# Altium project netv2mvp-dvt1.PrjPcb (part 1 of 2)
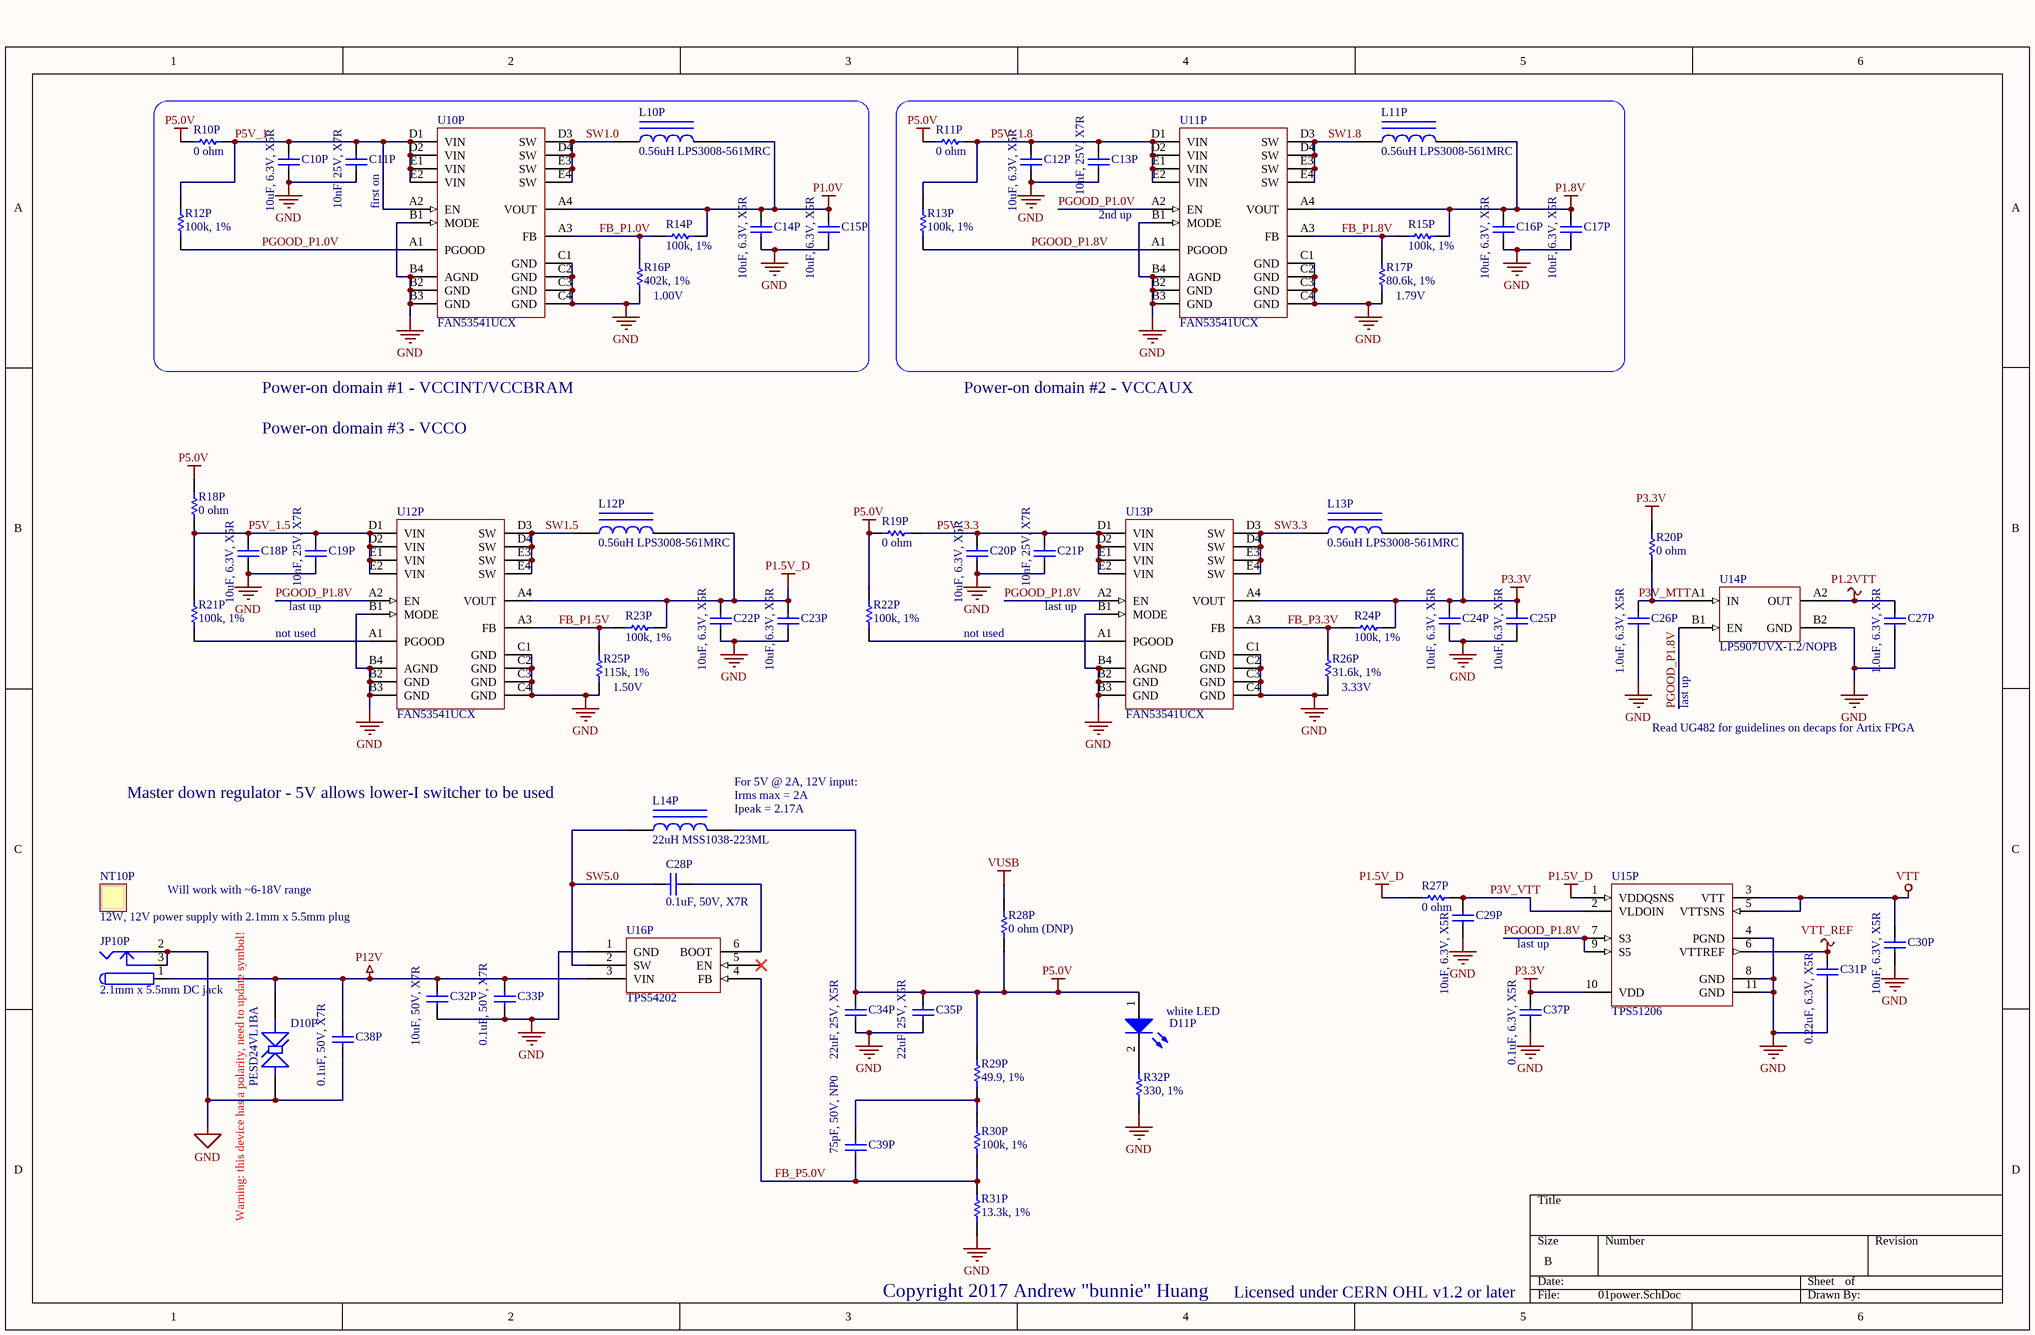
[diagram p0: 01power.SchDoc]
5 sheets, 330 parts. Net scope: global (net labels, ports and power ports of the same name join across sheets).
Board file: netv2mvp-dvt1a.PCBDOC
Sheets:
  01power.SchDoc
  02config.SchDoc
  03fpga.SchDoc
  04ddr3.SchDoc
  05io.SchDoc

## Sheet 01power.SchDoc
size B

### Parts
C10P  10uF, 6.3V, X5R  [CAPC1608N]
C11P  10nF, 25V, X7R  [CAPC1005N]
C12P  10uF, 6.3V, X5R  [CAPC1608N]
C13P  10nF, 25V, X7R  [CAPC1005N]
C14P  10uF, 6.3V, X5R  [CAPC1608N]
C15P  10uF, 6.3V, X5R  [CAPC1608N]
C16P  10uF, 6.3V, X5R  [CAPC1608N]
C17P  10uF, 6.3V, X5R  [CAPC1608N]
C18P  10uF, 6.3V, X5R  [CAPC1608N]
C19P  10nF, 25V, X7R  [CAPC1005N]
C20P  10uF, 6.3V, X5R  [CAPC1608N]
C21P  10nF, 25V, X7R  [CAPC1005N]
C22P  10uF, 6.3V, X5R  [CAPC1608N]
C23P  10uF, 6.3V, X5R  [CAPC1608N]
C24P  10uF, 6.3V, X5R  [CAPC1608N]
C25P  10uF, 6.3V, X5R  [CAPC1608N]
C26P  1.0uF, 6.3V, X5R  [CAPC0603X03L]
C27P  1.0uF, 6.3V, X5R  [CAPC0603X03L]
C28P  0.1uF, 50V, X7R  [CAPC2012N]
C29P  10uF, 6.3V, X5R  [CAPC1608N]
C30P  10uF, 6.3V, X5R  [CAPC1608N]
C31P  0.22uF, 6.3V, X5R  [CAPC0603X03L]
C32P  10uF, 50V, X7R  [CAPC3216N]
C33P  0.1uF, 50V, X7R  [CAPC2012N]
C34P  22uF, 25V, X5R  [CAPC3216N]
C35P  22uF, 25V, X5R  [CAPC3216N]
C37P  0.1uF, 6.3V, X5R  [CAPC0603X03L]
C38P  0.1uF, 50V, X7R  [CAPC2012N]
C39P  75pF, 50V, NP0  [CAPC1005N]
D10P  PESD24VL1BA  [SOD-323]
D11P  white LED  [CD2012-0805]
JP10P  2.1mm x 5.5mm DC jack  [CUI_PJ_002AH_SMT]
L10P  0.56uH LPS3008-561MRC  [COILCRAFT_LPS3008]
L11P  0.56uH LPS3008-561MRC  [COILCRAFT_LPS3008]
L12P  0.56uH LPS3008-561MRC  [COILCRAFT_LPS3008]
L13P  0.56uH LPS3008-561MRC  [COILCRAFT_LPS3008]
L14P  22uH MSS1038-223ML  [COILCRAFT_MSS1038]
NT10P  12W, 12V power supply with 2.1mm x 5.5mm plug
R10P  0 ohm  [RESC1608N]
R11P  0 ohm  [RESC1608N]
R12P  100k, 1%  [RESC1005N]
R13P  100k, 1%  [RESC1005N]
R14P  100k, 1%  [RESC1005N]
R15P  100k, 1%  [RESC1005N]
R16P  402k, 1%  [RESC1005N]
R17P  80.6k, 1%  [RESC1005N]
R18P  0 ohm  [RESC1608N]
R19P  0 ohm  [RESC1608N]
R20P  0 ohm  [RESC1608N]
R21P  100k, 1%  [RESC1005N]
R22P  100k, 1%  [RESC1005N]
R23P  100k, 1%  [RESC1005N]
R24P  100k, 1%  [RESC1005N]
R25P  115k, 1%  [RESC1005N]
R26P  31.6k, 1%  [RESC1005N]
R27P  0 ohm  [RESC1608N]
R28P  0 ohm (DNP)  [RESC1608N]
R29P  49.9, 1%  [RESC1005N]
R30P  100k, 1%  [RESC1005N]
R31P  13.3k, 1%  [RESC1005N]
R32P  330, 1%  [RESC1005N]
U10P  FAN53541UCX  [BGA20C40P4X5_156X196X62]
U11P  FAN53541UCX  [BGA20C40P4X5_156X196X62]
U12P  FAN53541UCX  [BGA20C40P4X5_156X196X62]
U13P  FAN53541UCX  [BGA20C40P4X5_156X196X62]
U14P  LP5907UVX-1.2/NOPB  [TI_YKE004]
U15P  TPS51206  [TI-DSQ-R-PWSON-N10]
U16P  TPS54202  [SOT26A-6N]

### Nets
GND: C10P.2 C11P.2 C12P.2 C13P.2 C14P.2 C15P.2 C16P.2 C17P.2 C18P.2 C19P.2 C20P.2 C21P.2 C22P.2 C23P.2 C24P.2 C25P.2 C26P.2 C27P.2 C29P.2 C30P.2 C31P.2 C32P.1 C33P.2 C34P.1 C35P.1 C37P.2 C38P.2 D10P.2(K) JP10P.2 JP10P.3 R16P.2 R17P.2 R25P.2 R26P.2 R31P.1 R32P.1 U10P.B1(MODE) U10P.B2(GND) U10P.B3(GND) U10P.B4(AGND) U10P.C1(GND) U10P.C2(GND) U10P.C3(GND) U10P.C4(GND) U11P.B1(MODE) U11P.B2(GND) U11P.B3(GND) U11P.B4(AGND) U11P.C1(GND) U11P.C2(GND) U11P.C3(GND) U11P.C4(GND) U12P.B1(MODE) U12P.B2(GND) U12P.B3(GND) U12P.B4(AGND) U12P.C1(GND) U12P.C2(GND) U12P.C3(GND) U12P.C4(GND) U13P.B1(MODE) U13P.B2(GND) U13P.B3(GND) U13P.B4(AGND) U13P.C1(GND) U13P.C2(GND) U13P.C3(GND) U13P.C4(GND) U14P.B2(GND) U15P.4(PGND) U15P.8(GND) U15P.11(GND) U16P.1(GND)
P1.0V: C14P.1 C15P.1 L10P.2 R14P.2 U10P.A4(VOUT)
P1.2VTT: C27P.1 U14P.A2(OUT)
P1.5V_D: C22P.1 C23P.1 L12P.2 R23P.2 R27P.2 U12P.A4(VOUT) U15P.1(VDDQSNS)
P1.8V: C16P.1 C17P.1 L11P.2 R15P.2 U11P.A4(VOUT)
P3.3V: C24P.1 C25P.1 C37P.1 L13P.2 R20P.2 R24P.2 U13P.A4(VOUT) U15P.10(VDD)
P5.0V: C34P.2 C35P.2 D11P.1(A) L14P.2 R10P.1 R11P.1 R18P.1 R19P.1 R22P.2 R28P.1 R29P.2
P12V: C32P.2 C33P.1 C38P.1 D10P.1(A) JP10P.1 U16P.3(VIN)
VTT: C30P.1 U15P.3(VTT) U15P.5(VTTSNS)
VTT_REF: C31P.1 U15P.6(VTTREF)
VUSB: R28P.2
FB_P1.0V: R14P.1 R16P.1 U10P.A3(FB)
FB_P1.5V: R23P.1 R25P.1 U12P.A3(FB)
FB_P1.8V: R15P.1 R17P.1 U11P.A3(FB)
FB_P3.3V: R24P.1 R26P.1 U13P.A3(FB)
FB_P5.0V: C39P.2 R30P.1 R31P.2 U16P.4(FB)
P3V_MTT: C26P.1 R20P.1 U14P.A1(IN)
P3V_VTT: C29P.1 R27P.1 U15P.2(VLDOIN)
P5V_1: C10P.1 C11P.1 R10P.2 R12P.2 U10P.A2(EN) U10P.D1(VIN) U10P.D2(VIN) U10P.E1(VIN) U10P.E2(VIN)
P5V_1.5: C18P.1 C19P.1 R18P.2 R21P.1 U12P.D1(VIN) U12P.D2(VIN) U12P.E1(VIN) U12P.E2(VIN)
P5V_1.8: C12P.1 C13P.1 R11P.2 R13P.2 U11P.D1(VIN) U11P.D2(VIN) U11P.E1(VIN) U11P.E2(VIN)
P5V_3.3: C20P.1 C21P.1 R19P.2 U13P.D1(VIN) U13P.D2(VIN) U13P.E1(VIN) U13P.E2(VIN)
PGOOD_P1.0V: R12P.1 U10P.A1(PGOOD) U11P.A2(EN)
PGOOD_P1.8V: R13P.1 U11P.A1(PGOOD) U12P.A2(EN) U13P.A2(EN) U14P.B1(EN) U15P.7(S3) U15P.9(S5)
SW1.0: L10P.1 U10P.D3(SW) U10P.D4(SW) U10P.E3(SW) U10P.E4(SW)
SW1.5: L12P.1 U12P.D3(SW) U12P.D4(SW) U12P.E3(SW) U12P.E4(SW)
SW1.8: L11P.1 U11P.D3(SW) U11P.D4(SW) U11P.E3(SW) U11P.E4(SW)
SW3.3: L13P.1 U13P.D3(SW) U13P.D4(SW) U13P.E3(SW) U13P.E4(SW)
SW5.0: C28P.1 L14P.1 U16P.2(SW)
NetC28P_2: C28P.2 U16P.6(BOOT)
NetC39P_1: C39P.1 R29P.1 R30P.2
NetD11P_2: D11P.2(K) R32P.2
NetR21P_2: R21P.2 U12P.A1(PGOOD)
NetR22P_1: R22P.1 U13P.A1(PGOOD)

Not connected (* = marked no-connect by the designer): U16P 5(EN)*

### Notes on the sheet
- (near C11P) first on
- 2nd up
- (near R16P) 1.00V
- (near R17P) 1.79V
- Power-on domain #1 - VCCINT/VCCBRAM
- Power-on domain #2 - VCCAUX
- Power-on domain #3 - VCCO
- last up
- not used
- (near R25P) 1.50V
- (near R26P) 3.33V
- Read UG482 for guidelines on decaps for Artix FPGA
- (near L14P) Master down regulator - 5V allows lower-I switcher to be used
- (near L14P) Irms max = 2A
- (near L14P) Ipeak = 2.17A
- (near L14P) For 5V @ 2A, 12V input:
- Will work with ~6-18V range
- (near D10P) Warning: this device has a polarity, need to update symbol!
- Copyright 2017 Andrew "bunnie" Huang
- Licensed under CERN OHL v1.2 or later

### Library data of the parts
C10P C12P C14P C15P C16P C17P C18P C20P C22P C23P C24P C25P C29P C30P = Cap Semi: Capacitor (Semiconductor SIM Model); MPN: CL10A106MQ8NNNC; VENDOR: Samsung; MYPN: C-106-6.3-X5R-0603
C11P C13P C19P C21P = Cap Semi: Capacitor (Semiconductor SIM Model); MPN: CL05B103KA5NNNC; VENDOR: Samsung; MYPN: C-103-25-X7R-0402
C26P C27P = Cap Semi: Capacitor (Semiconductor SIM Model); MPN: CL03A105KQ3CSNC; VENDOR: Samsung; MYPN: C-105-6p3-X5R-0201
C28P C33P C38P = Cap Semi: Capacitor (Semiconductor SIM Model); MPN: CL21B104KBCNNWC; VENDOR: Samsung; MYPN: C-104-50-X7R-0805
C31P = Cap Semi: Capacitor (Semiconductor SIM Model); MPN: CL03A224MQ3NNNC; VENDOR: Samsung; MYPN: C-224-6p3-X5R-0201
C32P = Cap Semi: Capacitor (Semiconductor SIM Model); MPN: CL31A106KBHNNNE; VENDOR: Samsung; MYPN: C-106-50-X5R-1206
C34P C35P = Cap Semi: Capacitor (Semiconductor SIM Model); MPN: CL31A226KAHNNNE; VENDOR: Samsung; MYPN: C-226-25-X5R-1206
C37P = Cap Semi: Capacitor (Semiconductor SIM Model); MPN: CL03A104KQ3NNNC; VENDOR: Samsung; MYPN: C-104-6p3-X5R-0201
C39P = Cap Semi: Capacitor (Semiconductor SIM Model); MPN: CL05C750JB5NNNC; VENDOR: Samsung; MYPN: C-750-50-NP0-0402
D10P = BIDIR_ESD: Bidirectional zener diode, Vz 17.1V nom; MPN: PESD24VL1BA,115; MYPN: U-PESD24VL1BA,115; VENDOR: NXP
D11P = LED2: Typical RED, GREEN, YELLOW, AMBER GaAs LED; MPN: CB-2012QWC-P8; VENDOR: CITYBRIGHT; MYPN: D-LED-WHITE1-0805
JP10P = PWR2.5: Low Voltage Power Supply Connector; MPN: PJ-002AH-SMT-TR; MYPN: J-PJ-002AH-SMT-TR; VENDOR: CUI Inc; Published: 17-Dec-2003; Datasheet: Latest Revision: 09-May-2002; Publisher: Altium Limited
L10P L11P L12P L13P = Inductor Iron: Magnetic-Core Inductor; VENDOR: COILCRAFT; MYPN: L-LPS3008-561MR; MPN: LPS3008-561MRC
L14P = Inductor Iron: Magnetic-Core Inductor; MPN: MSS1038-223MLB; VENDOR: COILCRAFT; MYPN: L-MSS1038-223MLB
NT10P = NOTE: Placeholder for non-board BOM items; MPN: ANY; MYPN: NT-ACDC-12W-12V-P2.1; VENDOR: ANY
R10P R11P R18P R19P R20P R27P = Res1: Resistor; VENDOR: ANY; MYPN: R-0R0-1P-1_16W-0603; MPN: ANY
R12P R13P R14P R15P R21P R22P R23P R24P R30P = Res1: Resistor; VENDOR: ANY; MYPN: R-104-1P-1_16W-0402; MPN: ANY
R16P = Res1: Resistor; VENDOR: ANY; MYPN: R-4023-1P-1_16W-0402; MPN: ANY
R17P = Res1: Resistor; VENDOR: ANY; MYPN: R-8062-1P-1_16W-0402; MPN: ANY
R25P = Res1: Resistor; VENDOR: ANY; MYPN: R-1153-1P-1_16W-0402; MPN: ANY
R26P = Res1: Resistor; VENDOR: ANY; MYPN: R-3162-1P-1_16W-0402; MPN: ANY
R28P = Res1: Resistor; VENDOR: ANY; MYPN: DNP; MPN: DNP
R29P = Res1: Resistor; VENDOR: ANY; MYPN: R-49R9-1P-1_16W-0402; MPN: ANY
R31P = Res1: Resistor; VENDOR: ANY; MYPN: R-1332-1P-1_16W-0402; MPN: ANY
R32P = Res1: Resistor; MPN: RS02U331FT; VENDOR: Fenghua; MYPN: R-331-1P-1_16W-0402
U10P U11P U12P U13P = FAN53541UCX: 2.4MHz, 5A TinyBuck Synchronous Buck Regulator; MYPN: UFAN53541UCX; VENDOR: Fairchild Semiconductor; MPN: FAN53541UCX
U14P = LP5907UVX: Ultra low-noise 250mA LDO for RF and analog in DSBGA; VENDOR: TI; MYPN: ULP5907UVX-1.2; MPN: LP5907UVX-1.2/NOPB
U15P = TPS51206: 2A-peak sink/source DDR termination regulator; MPN: TPS51206DSQ(T/R); MYPN: UTPS51206DSQ; VENDOR: TI
U16P = TPS54202: 4.5 to 28V input, 2A output, step down sync buck; MPN: TPS54202DDCT; MYPN: U-TPS54202DDCT; VENDOR: TI

## Sheet 02config.SchDoc
size B
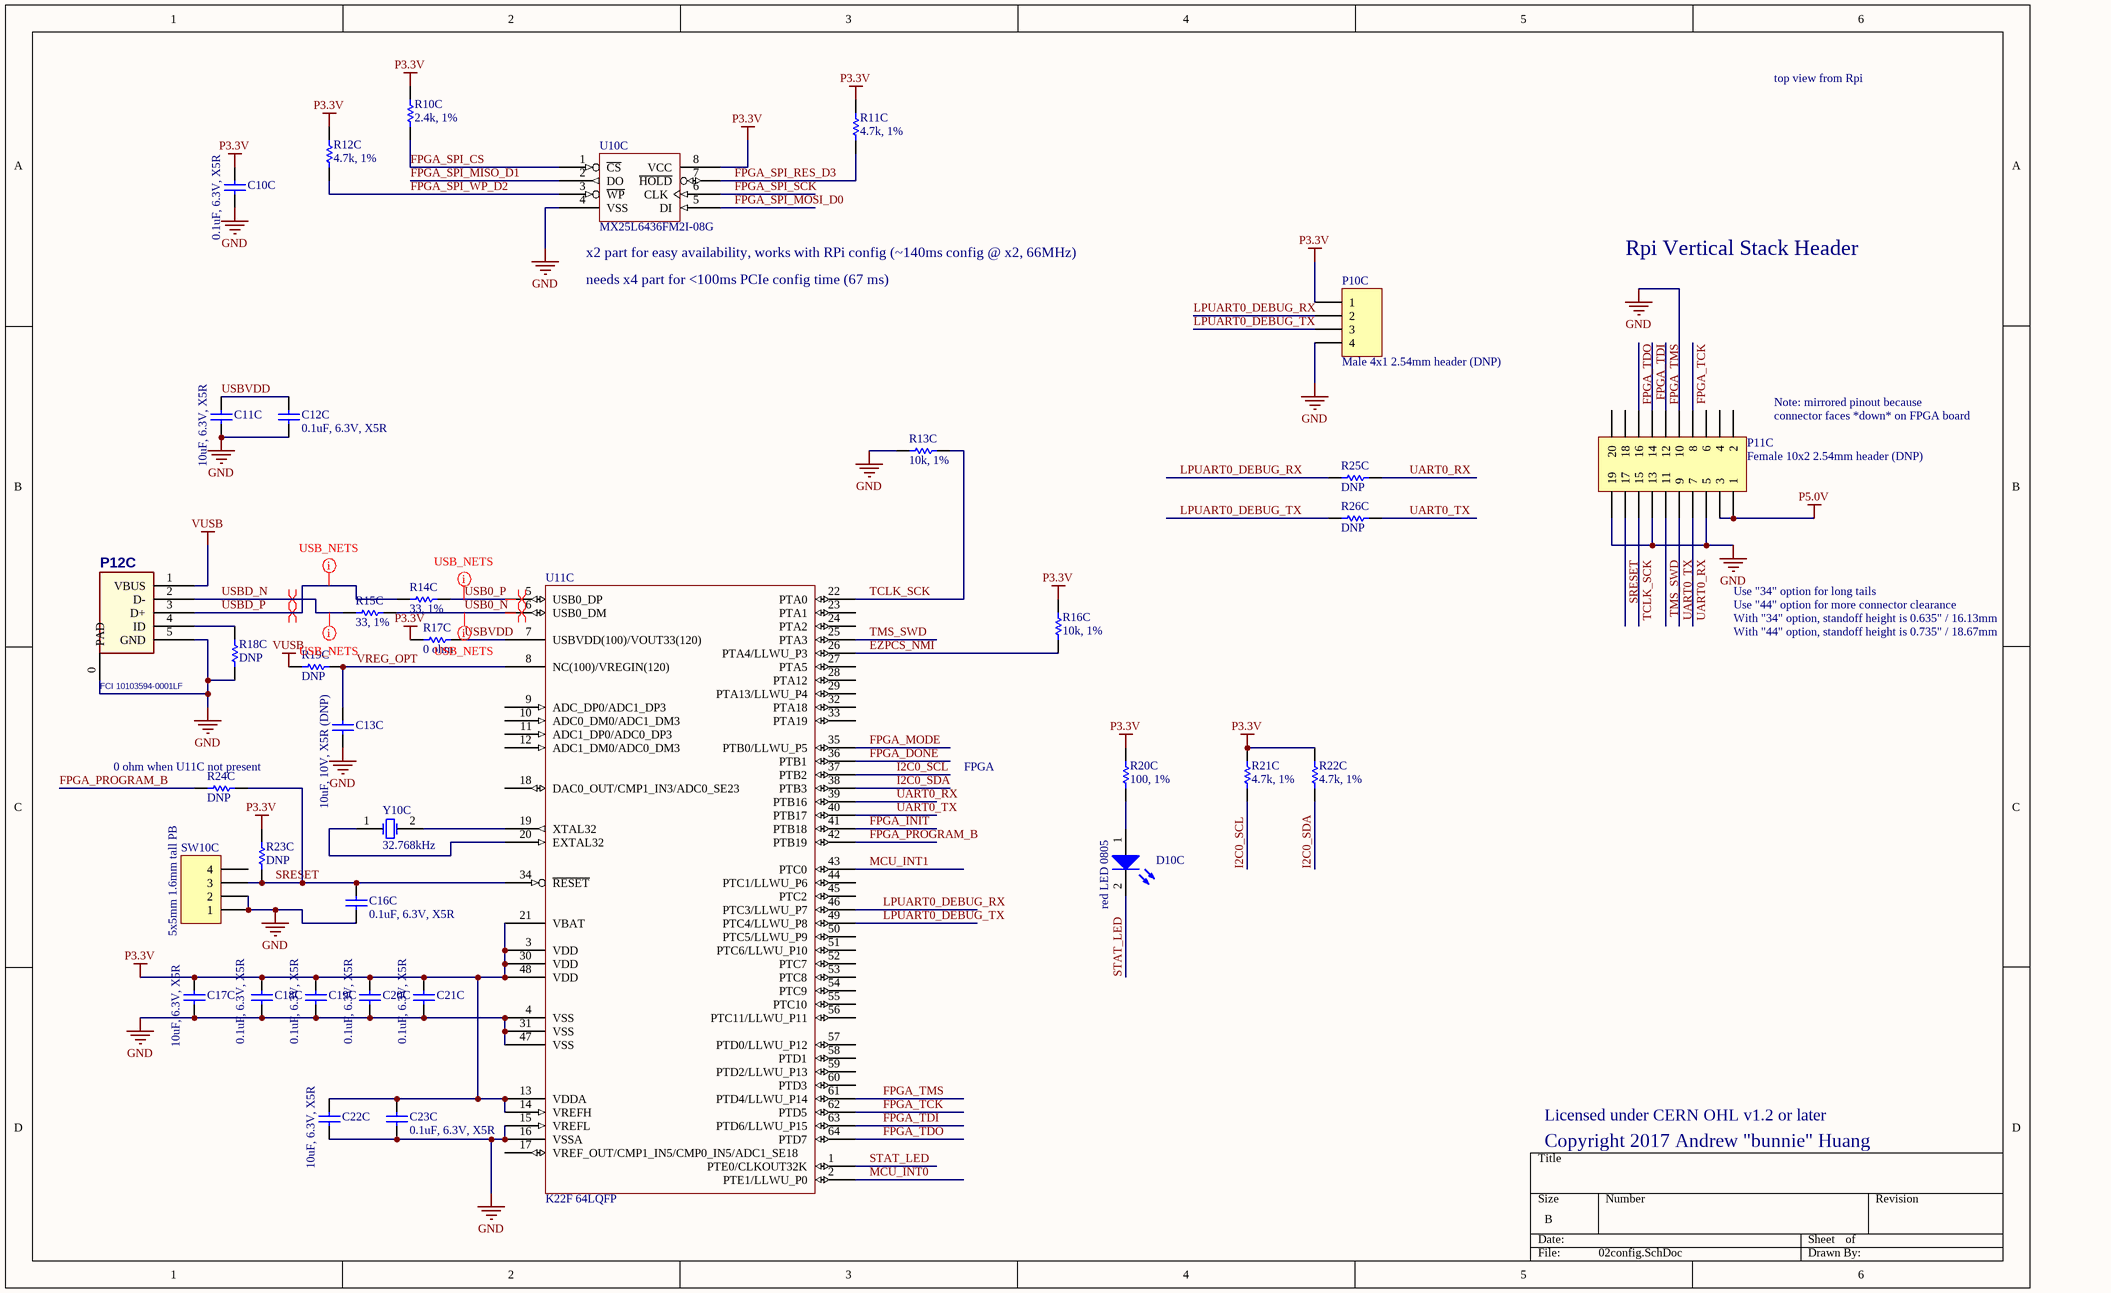
[diagram p1: 02config.SchDoc]

### Parts
C10C  0.1uF, 6.3V, X5R  [CAPC0603X03L]
C11C  10uF, 6.3V, X5R  [CAPC1608N]
C12C  0.1uF, 6.3V, X5R  [CAPC0603X03L]
C13C  10uF, 10V, X5R (DNP)  [CAPC2012N]
C16C  0.1uF, 6.3V, X5R  [CAPC0603X03L]
C17C  10uF, 6.3V, X5R  [CAPC1608N]
C18C  0.1uF, 6.3V, X5R  [CAPC0603X03L]
C19C  0.1uF, 6.3V, X5R  [CAPC0603X03L]
C20C  0.1uF, 6.3V, X5R  [CAPC0603X03L]
C21C  0.1uF, 6.3V, X5R  [CAPC0603X03L]
C22C  10uF, 6.3V, X5R  [CAPC1608N]
C23C  0.1uF, 6.3V, X5R  [CAPC0603X03L]
D10C  red LED 0805  [CD2012-0805]
P10C  Male 4x1 2.54mm header (DNP)  [HDR1X4]
P11C  Female 10x2 2.54mm header (DNP)  [HDR2X10]
P12C  FCI 10103594-0001LF  [USB_MICRO_B_SMT]
R10C  2.4k, 1%  [CAPC0603X03L]
R11C  4.7k, 1%  [RESC1005N]
R12C  4.7k, 1%  [RESC1005N]
R13C  10k, 1%  [RESC1005N]
R14C  33, 1%  [RESC1005N]
R15C  33, 1%  [RESC1005N]
R16C  10k, 1%  [RESC1005N]
R17C  0 ohm  [RESC1005N]
R18C  DNP  [RESC1005N]
R19C  DNP  [RESC1005N]
R20C  100, 1%  [RESC1005N]
R21C  4.7k, 1%  [RESC1005N]
R22C  4.7k, 1%  [RESC1005N]
R23C  DNP  [RESC1005N]
R24C  DNP  [RESC1005N]
R25C  DNP  [RESC1005N]
R26C  DNP  [RESC1005N]
SW10C  5x5mm 1.6mm tall PB  [SWITCH_TS-1187A]
U10C  MX25L6436FM2I-08G  [SOIC127P790X216-8N]
U11C  K22F 64LQFP  [TSQFP50P1200X1200-64N]
Y10C  32.768kHz  [ABS07-120]

### Nets
GND: C10C.2 C11C.2 C12C.2 C13C.2 C16C.2 C17C.2 C18C.2 C19C.2 C20C.2 C21C.2 C22C.2 C23C.2 P10C.4 P11C.5 P11C.10 P11C.13 P11C.19 P12C.0(PAD) P12C.5(GND) R13C.2 R18C.2 SW10C.1 SW10C.2 U10C.4(VSS) U11C.4(VSS) U11C.15(VREFL) U11C.16(VSSA) U11C.31(VSS) U11C.47(VSS)
P3.3V: C10C.1 C17C.1 C18C.1 C19C.1 C20C.1 C21C.1 C22C.1 C23C.1 P10C.1 R10C.1 R11C.1 R12C.1 R16C.1 R17C.2 R20C.2 R21C.2 R22C.2 R23C.1 U10C.8(VCC) U11C.3(VDD) U11C.13(VDDA) U11C.14(VREFH) U11C.21(VBAT) U11C.30(VDD) U11C.48(VDD)
P5.0V: P11C.1 P11C.3
VUSB: P12C.1(VBUS) R19C.2
EZPCS_NMI: R16C.2 U11C.26(PTA4/LLWU_P3)
FPGA_DONE: U11C.36(PTB1)
FPGA_INIT: U11C.41(PTB18)
FPGA_MODE: U11C.35(PTB0/LLWU_P5)
FPGA_PROGRAM_B: R24C.1 U11C.42(PTB19)
FPGA_SPI_CS: R10C.2 U10C.1(~{CS})
FPGA_SPI_MISO_D1: U10C.2(DO)
FPGA_SPI_MOSI_D0: U10C.5(DI)
FPGA_SPI_RES_D3: R11C.2 U10C.7(~{HOLD})
FPGA_SPI_SCK: U10C.6(CLK)
FPGA_SPI_WP_D2: R12C.2 U10C.3(~{WP})
FPGA_TCK: P11C.8 U11C.62(PTD5)
FPGA_TDI: P11C.14 U11C.63(PTD6/LLWU_P15)
FPGA_TDO: P11C.16 U11C.64(PTD7)
FPGA_TMS: P11C.12 U11C.61(PTD4/LLWU_P14)
I2C0_SCL: R21C.1 U11C.37(PTB2)
I2C0_SDA: R22C.1 U11C.38(PTB3)
LPUART0_DEBUG_RX: P10C.2 R25C.2 U11C.46(PTC3/LLWU_P7)
LPUART0_DEBUG_TX: P10C.3 R26C.2 U11C.49(PTC4/LLWU_P8)
MCU_INT0: U11C.2(PTE1/LLWU_P0)
MCU_INT1: U11C.43(PTC0)
SRESET: C16C.1 P11C.17 R23C.2 R24C.2 SW10C.3 U11C.34(~{RESET})
STAT_LED: D10C.2(K) U11C.1(PTE0/CLKOUT32K)
TCLK_SCK: P11C.15 R13C.1 U11C.22(PTA0)
TMS_SWD: P11C.11 U11C.25(PTA3)
UART0_RX: P11C.7 R25C.1 U11C.39(PTB16)
UART0_TX: P11C.9 R26C.1 U11C.40(PTB17)
USB0_N: R15C.2 U11C.6(USB0_DM)
USB0_P: R14C.2 U11C.5(USB0_DP)
USBD_N: P12C.2(D-) R15C.1
USBD_P: P12C.3(D+) R14C.1
USBVDD: C11C.1 C12C.1 R17C.1 U11C.7(USBVDD(100)/VOUT33(120))
VREG_OPT: C13C.1 R19C.1 U11C.8(NC(100)/VREGIN(120))
NetD10C_1: D10C.1(A) R20C.1
NetP12C_4: P12C.4(ID) R18C.1
NetU11C_19: U11C.19(XTAL32) Y10C.2(OSC2)
NetU11C_20: U11C.20(EXTAL32) Y10C.1(OSC1)

Not connected (* = marked no-connect by the designer): P11C 2 4 6 18 20; SW10C 4; U11C 9(ADC_DP0/ADC1_DP3) 10(ADC0_DM0/ADC1_DM3) 11(ADC1_DP0/ADC0_DP3) 12(ADC1_DM0/ADC0_DM3) 17(VREF_OUT/CMP1_IN5/CMP0_IN5/ADC1_SE18) 18(DAC0_OUT/CMP1_IN3/ADC0_SE23) 23(PTA1) 24(PTA2) 27(PTA5) 28(PTA12) 29(PTA13/LLWU_P4) 32(PTA18) 33(PTA19) 44(PTC1/LLWU_P6) 45(PTC2) 50(PTC5/LLWU_P9) 51(PTC6/LLWU_P10) 52(PTC7) 53(PTC8) 54(PTC9) 55(PTC10) 56(PTC11/LLWU_P11) 57(PTD0/LLWU_P12) 58(PTD1) 59(PTD2/LLWU_P13) 60(PTD3)

### Layout directives
differential pair: USB0_N, USB0_P, USBD_N, USBD_P
net class USB_NETS: USB0_N, USB0_P, USBD_N, USBD_P

### Notes on the sheet
- top view from Rpi
- (near U10C) x2 part for easy availability, works with RPi config (~140ms config @ x2, 66MHz)
- needs x4 part for <100ms PCIe config time (67 ms)
- Rpi Vertical Stack Header
- (near P11C) Note: mirrored pinout because
- (near P11C) connector faces *down* on FPGA board
- Use "34" option for long tails
- Use "44" option for more connector clearance
- With "44" option, standoff height is 0.735" / 18.67mm
- With "34" option, standoff height is 0.635" / 16.13mm
- (near R24C) 0 ohm when U11C not present
- FPGA
- Licensed under CERN OHL v1.2 or later
- Copyright 2017 Andrew "bunnie" Huang

### Library data of the parts
C10C C12C C16C C18C C19C C20C C21C C23C = Cap Semi: as C37P on sheet 01power
C11C C17C C22C = Cap Semi: as C10P on sheet 01power
C13C = Cap Semi: Capacitor (Semiconductor SIM Model); VENDOR: Samsung; MPN: DNP; MYPN: DNP
D10C = LED2: Red LED; MPN: CB-2012QRC-P8; MYPN: D-LED-RED-0805; VENDOR: Cheng Guang Xing; Published: 8-Jun-2000; LatestRevisionDate: 17-Jul-2002; LatestRevisionNote: Re-released for DXP Platform.; PackageVersion: Feb-2002; PackageReference: 3.2X1.6X1.1; Publisher: Altium Limited
P10C = Header 4: Header, 4-Pin; MYPN: J-HDR-2.54-4x1-STD-DNP; LatestRevisionDate: 17-Jul-2002; LatestRevisionNote: Re-released for DXP Platform.; Publisher: Altium Limited; MPN: DNP; VENDOR: DNP
P11C = Header 10X2: Header, 10-Pin, Dual row; MPN: (ESQ/ESW)-110-(34/44/69)-(L/G)-D; VENDOR: Samtech; MYPN: ESW-110-44-L-D; LatestRevisionDate: 17-Jul-2002; LatestRevisionNote: Re-released for DXP Platform.; Publisher: Altium Limited
P12C = USB_MINI-AB_1: Micro USB B type connector; VENDOR: FCI/BERG; MYPN: J-MICROUSB-SMT-FCI; MPN: 10103594-0001LF
R10C = Res1: Resistor; VENDOR: ANY; MYPN: R-242-1P-1_16W-0201; MPN: ANY
R11C R12C = Res1: Resistor; MPN: RS02U472FT; VENDOR: Fenghua; MYPN: R-472-1P-1_16W-0402
R13C R16C = Res1: Resistor; MPN: RS02U103FT; VENDOR: Fenghua; MYPN: R-103-1P-1_16W-0402
R14C R15C = Res1: Resistor; MPN: RS02U330FT; VENDOR: Fenghua; MYPN: R-330-1P-1_16W-0402
R17C = Res1: Resistor; VENDOR: ANY; MYPN: R-0R0-1P-1_16W-0402; MPN: ANY
R18C R19C R24C R25C R26C = Res1: Resistor; VENDOR: ANY; MYPN: DNP; MPN: ANY
R20C = Res1: Resistor; MPN: RS02U101FT; VENDOR: Fenghua; MYPN: R-101-1P-1_16W-0402
R21C R22C = Res1: Resistor; VENDOR: ANY; MYPN: R-472-1P-1_16W-0402; MPN: ANY
R23C = Res1: Resistor; VENDOR: Fenghua; MYPN: DNP; MPN: DNP
SW10C = Header 4: Chi Fung TS-1187A; MPN: SW-PB-5X5-1.6; VENDOR: Kangdeli; LatestRevisionDate: 17-Jul-2002; LatestRevisionNote: Re-released for DXP Platform.; Publisher: Altium Limited; MYPN: SW-PB-5X5-1.6
U10C = EN25P05-50GCP: 64Mbit SPI NOR FLASH; MYPN: UMX25L6436FM2I-08G; VENDOR: Macronix; MPN: MX25L6436FM2I-08G
U11C = MK22-64LQFP: NXP K22F series 64LQFP device; MPN: MK22FN128VLH10; MFG: NXP/FREESCALE; MYPN: U-MK22FN128VLH10
Y10C = XTAL: 3.2 x 1.5mm 32.768 kHz crystal, 6pF CL 70k ESR, 20ppm; MPN: SJFC1332K06F20; VENDOR: Songji; MYPN: X-32.768K-SONGJI

## Sheet 03fpga.SchDoc
size C
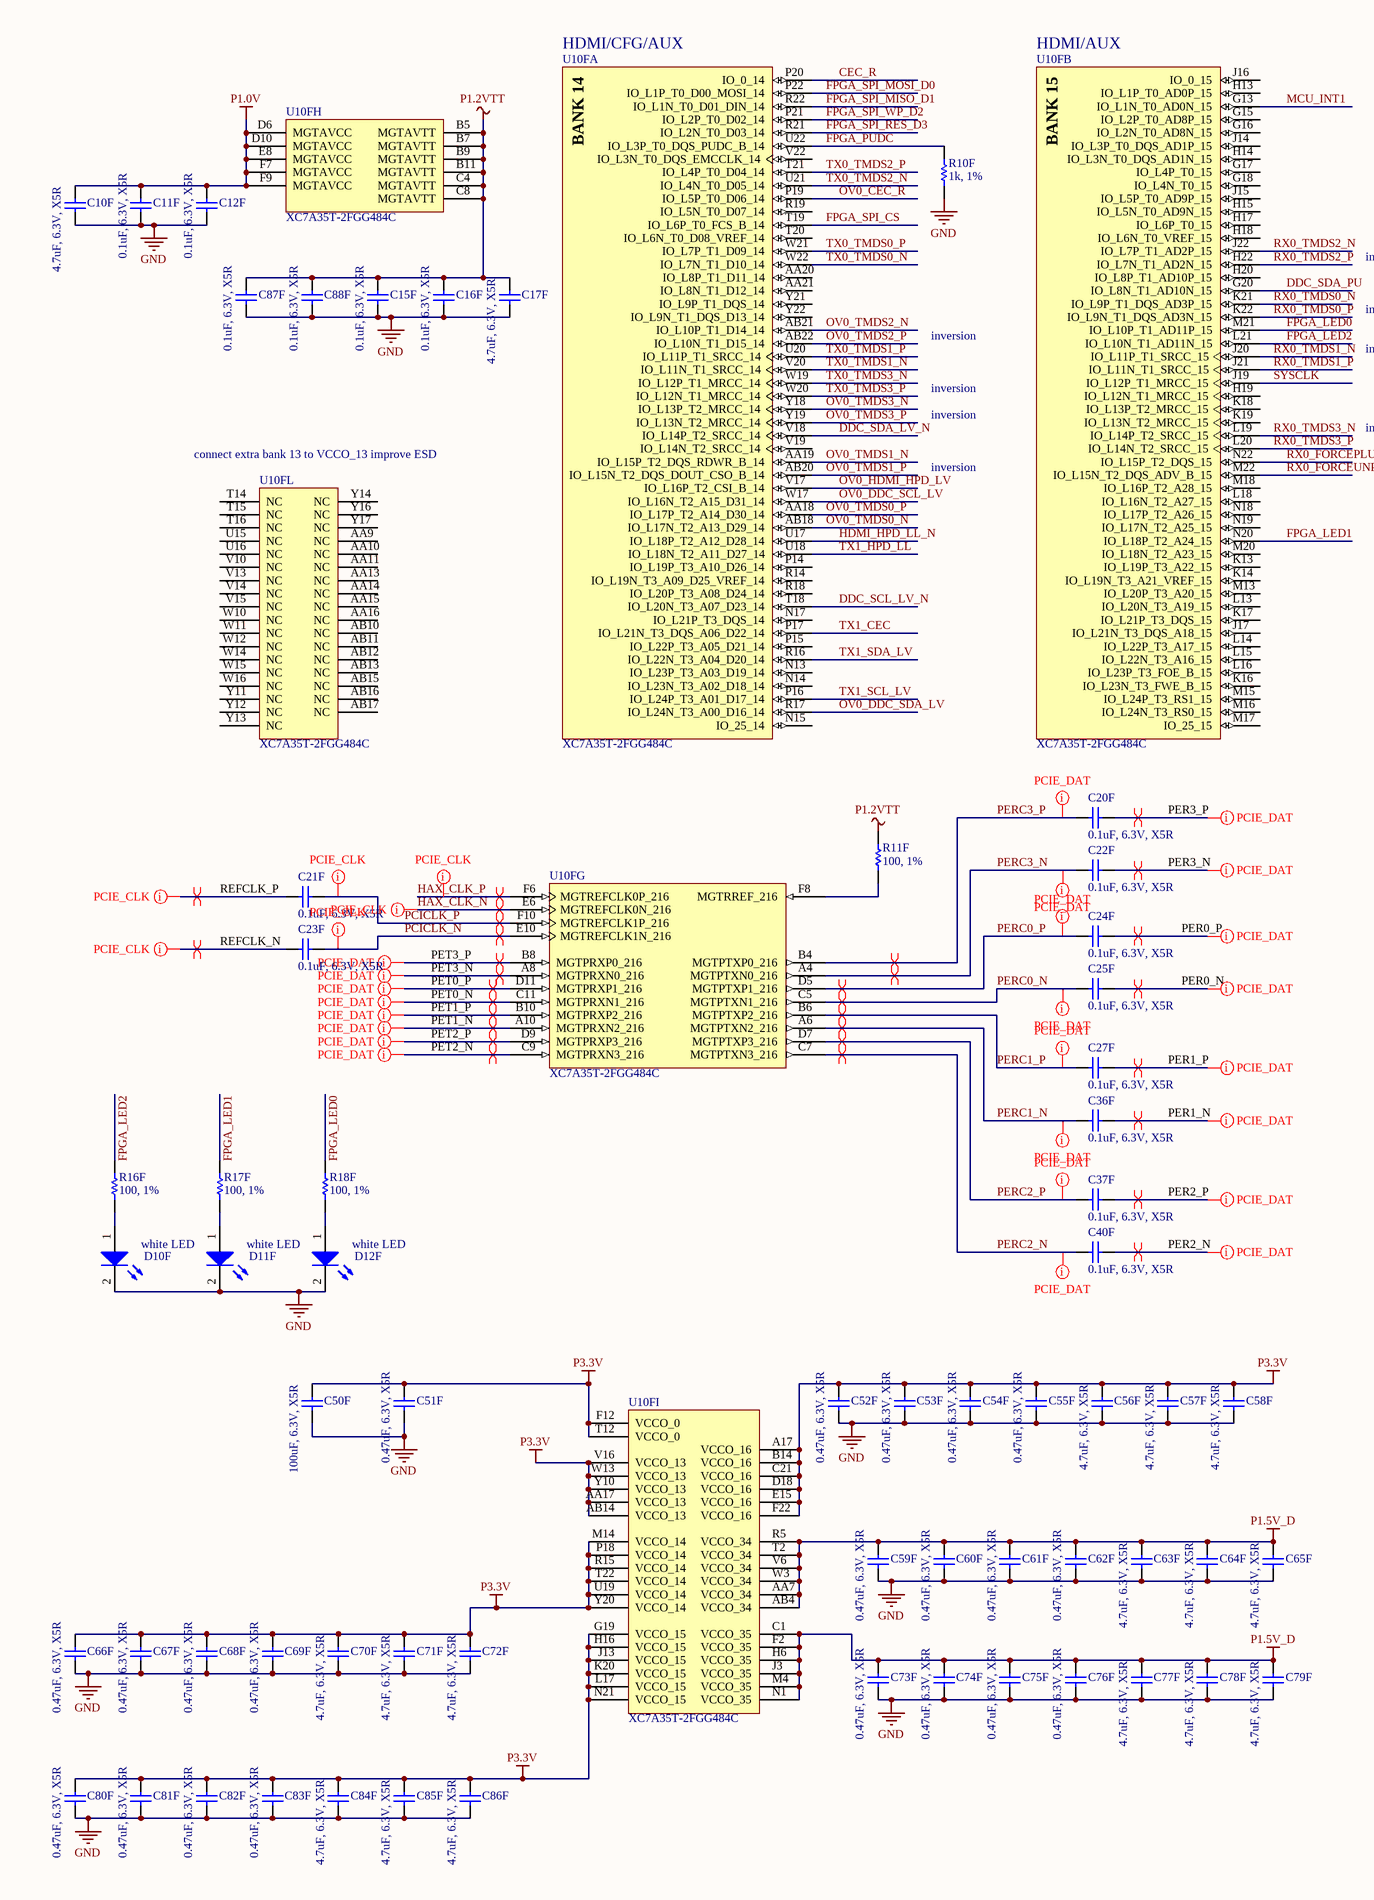
[diagram p2: 03fpga.SchDoc, left]
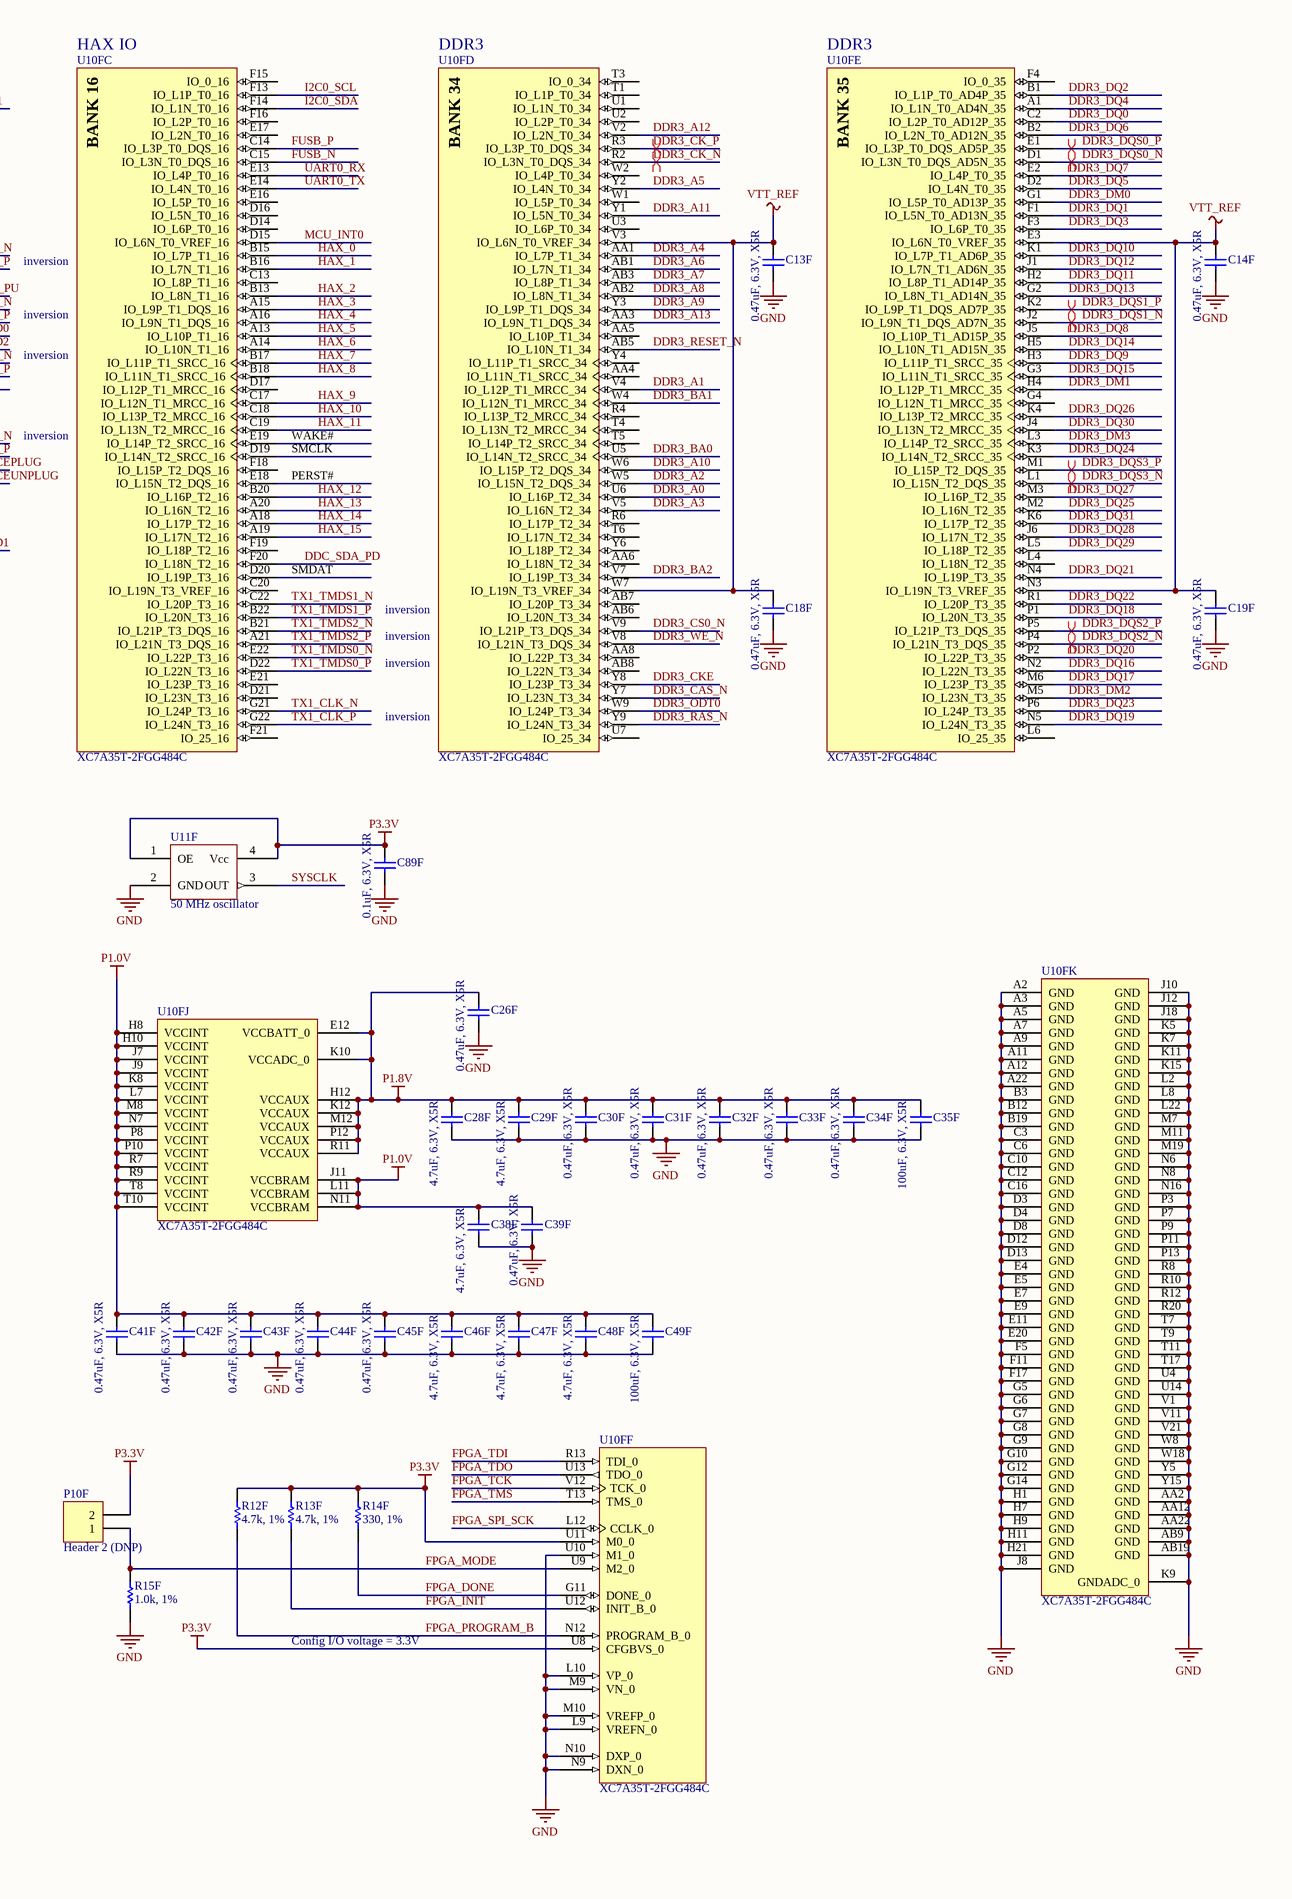
[diagram p3: 03fpga.SchDoc, right]

### Parts
C10F  4.7uF, 6.3V, X5R  [CAPC1005N]
C11F  0.1uF, 6.3V, X5R  [CAPC0603X03L]
C12F  0.1uF, 6.3V, X5R  [CAPC0603X03L]
C13F  0.47uF, 6.3V, X5R  [CAPC0603X03L]
C14F  0.47uF, 6.3V, X5R  [CAPC0603X03L]
C15F  0.1uF, 6.3V, X5R  [CAPC0603X03L]
C16F  0.1uF, 6.3V, X5R  [CAPC0603X03L]
C17F  4.7uF, 6.3V, X5R  [CAPC1005N]
C18F  0.47uF, 6.3V, X5R  [CAPC0603X03L]
C19F  0.47uF, 6.3V, X5R  [CAPC0603X03L]
C20F  0.1uF, 6.3V, X5R  [CAPC0603X03L]
C21F  0.1uF, 6.3V, X5R  [CAPC0603X03L]
C22F  0.1uF, 6.3V, X5R  [CAPC0603X03L]
C23F  0.1uF, 6.3V, X5R  [CAPC0603X03L]
C24F  0.1uF, 6.3V, X5R  [CAPC0603X03L]
C25F  0.1uF, 6.3V, X5R  [CAPC0603X03L]
C26F  0.47uF, 6.3V, X5R  [CAPC0603X03L]
C27F  0.1uF, 6.3V, X5R  [CAPC0603X03L]
C28F  4.7uF, 6.3V, X5R  [CAPC1005N]
C29F  4.7uF, 6.3V, X5R  [CAPC1005N]
C30F  0.47uF, 6.3V, X5R  [CAPC0603X03L]
C31F  0.47uF, 6.3V, X5R  [CAPC0603X03L]
C32F  0.47uF, 6.3V, X5R  [CAPC0603X03L]
C33F  0.47uF, 6.3V, X5R  [CAPC0603X03L]
C34F  0.47uF, 6.3V, X5R  [CAPC0603X03L]
C35F  100uF, 6.3V, X5R  [CAPC3216N]
C36F  0.1uF, 6.3V, X5R  [CAPC0603X03L]
C37F  0.1uF, 6.3V, X5R  [CAPC0603X03L]
C38F  4.7uF, 6.3V, X5R  [CAPC1005N]
C39F  0.47uF, 6.3V, X5R  [CAPC0603X03L]
C40F  0.1uF, 6.3V, X5R  [CAPC0603X03L]
C41F  0.47uF, 6.3V, X5R  [CAPC0603X03L]
C42F  0.47uF, 6.3V, X5R  [CAPC0603X03L]
C43F  0.47uF, 6.3V, X5R  [CAPC0603X03L]
C44F  0.47uF, 6.3V, X5R  [CAPC0603X03L]
C45F  0.47uF, 6.3V, X5R  [CAPC0603X03L]
C46F  4.7uF, 6.3V, X5R  [CAPC1005N]
C47F  4.7uF, 6.3V, X5R  [CAPC1005N]
C48F  4.7uF, 6.3V, X5R  [CAPC1005N]
C49F  100uF, 6.3V, X5R  [CAPC3216N]
C50F  100uF, 6.3V, X5R  [CAPC3216N]
C51F  0.47uF, 6.3V, X5R  [CAPC0603X03L]
C52F  0.47uF, 6.3V, X5R  [CAPC0603X03L]
C53F  0.47uF, 6.3V, X5R  [CAPC0603X03L]
C54F  0.47uF, 6.3V, X5R  [CAPC0603X03L]
C55F  0.47uF, 6.3V, X5R  [CAPC0603X03L]
C56F  4.7uF, 6.3V, X5R  [CAPC1005N]
C57F  4.7uF, 6.3V, X5R  [CAPC1005N]
C58F  4.7uF, 6.3V, X5R  [CAPC1005N]
C59F  0.47uF, 6.3V, X5R  [CAPC0603X03L]
C60F  0.47uF, 6.3V, X5R  [CAPC0603X03L]
C61F  0.47uF, 6.3V, X5R  [CAPC0603X03L]
C62F  0.47uF, 6.3V, X5R  [CAPC0603X03L]
C63F  4.7uF, 6.3V, X5R  [CAPC1005N]
C64F  4.7uF, 6.3V, X5R  [CAPC1005N]
C65F  4.7uF, 6.3V, X5R  [CAPC1005N]
C66F  0.47uF, 6.3V, X5R  [CAPC0603X03L]
C67F  0.47uF, 6.3V, X5R  [CAPC0603X03L]
C68F  0.47uF, 6.3V, X5R  [CAPC0603X03L]
C69F  0.47uF, 6.3V, X5R  [CAPC0603X03L]
C70F  4.7uF, 6.3V, X5R  [CAPC1005N]
C71F  4.7uF, 6.3V, X5R  [CAPC1005N]
C72F  4.7uF, 6.3V, X5R  [CAPC1005N]
C73F  0.47uF, 6.3V, X5R  [CAPC0603X03L]
C74F  0.47uF, 6.3V, X5R  [CAPC0603X03L]
C75F  0.47uF, 6.3V, X5R  [CAPC0603X03L]
C76F  0.47uF, 6.3V, X5R  [CAPC0603X03L]
C77F  4.7uF, 6.3V, X5R  [CAPC1005N]
C78F  4.7uF, 6.3V, X5R  [CAPC1005N]
C79F  4.7uF, 6.3V, X5R  [CAPC1005N]
C80F  0.47uF, 6.3V, X5R  [CAPC0603X03L]
C81F  0.47uF, 6.3V, X5R  [CAPC0603X03L]
C82F  0.47uF, 6.3V, X5R  [CAPC0603X03L]
C83F  0.47uF, 6.3V, X5R  [CAPC0603X03L]
C84F  4.7uF, 6.3V, X5R  [CAPC1005N]
C85F  4.7uF, 6.3V, X5R  [CAPC1005N]
C86F  4.7uF, 6.3V, X5R  [CAPC1005N]
C87F  0.1uF, 6.3V, X5R  [CAPC0603X03L]
C88F  0.1uF, 6.3V, X5R  [CAPC0603X03L]
C89F  0.1uF, 6.3V, X5R  [CAPC0603X03L]
D10F  white LED  [CD2012-0805]
D11F  white LED  [CD2012-0805]
D12F  white LED  [CD2012-0805]
P10F  Header 2 (DNP)  [HDR1X2]
R10F  1k, 1%  [RESC1005N]
R11F  100, 1%  [RESC1005N]
R12F  4.7k, 1%  [RESC1005N]
R13F  4.7k, 1%  [RESC1005N]
R14F  330, 1%  [RESC1005N]
R15F  1.0k, 1%  [RESC1005N]
R16F  100, 1%  [RESC1005N]
R17F  100, 1%  [RESC1005N]
R18F  100, 1%  [RESC1005N]
U10F  XC7A35T-2FGG484C  [FGG484]  (parts A,B,C,D,E,F,G,H,I,J,K,L of 12)
U11F  50 MHz oscillator  [ABRACON_ASDMB]

### Nets
GND: C10F.2 C11F.2 C12F.2 C13F.2 C14F.2 C15F.2 C16F.2 C17F.2 C18F.2 C19F.2 C26F.2 C28F.2 C29F.2 C30F.2 C31F.2 C32F.2 C33F.2 C34F.2 C35F.2 C38F.2 C39F.2 C41F.2 C42F.2 C43F.2 C44F.2 C45F.2 C46F.2 C47F.2 C48F.2 C49F.2 C50F.2 C51F.2 C52F.2 C53F.2 C54F.2 C55F.2 C56F.2 C57F.2 C58F.2 C59F.2 C60F.2 C61F.2 C62F.2 C63F.2 C64F.2 C65F.2 C66F.2 C67F.2 C68F.2 C69F.2 C70F.2 C71F.2 C72F.2 C73F.2 C74F.2 C75F.2 C76F.2 C77F.2 C78F.2 C79F.2 C80F.2 C81F.2 C82F.2 C83F.2 C84F.2 C85F.2 C86F.2 C87F.2 C88F.2 C89F.2 D10F.2(K) D11F.2(K) D12F.2(K) R10F.2 R15F.1 U10F.A2(GND) U10F.A3(GND) U10F.A5(GND) U10F.A7(GND) U10F.A9(GND) U10F.A11(GND) U10F.A12(GND) U10F.A22(GND) U10F.AA2(GND) U10F.AA12(GND) U10F.AA22(GND) U10F.AB9(GND) U10F.AB19(GND) U10F.B3(GND) U10F.B12(GND) U10F.B19(GND) U10F.C3(GND) U10F.C6(GND) U10F.C10(GND) U10F.C12(GND) U10F.C16(GND) U10F.D3(GND) U10F.D4(GND) U10F.D8(GND) U10F.D12(GND) U10F.D13(GND) U10F.E4(GND) U10F.E5(GND) U10F.E7(GND) U10F.E9(GND) U10F.E11(GND) U10F.E20(GND) U10F.F5(GND) U10F.F11(GND) U10F.F17(GND) U10F.G5(GND) U10F.G6(GND) U10F.G7(GND) U10F.G8(GND) U10F.G9(GND) U10F.G10(GND) U10F.G12(GND) U10F.G14(GND) U10F.H1(GND) U10F.H7(GND) U10F.H9(GND) U10F.H11(GND) U10F.H21(GND) U10F.J8(GND) U10F.J10(GND) U10F.J12(GND) U10F.J18(GND) U10F.K5(GND) U10F.K7(GND) U10F.K9(GNDADC_0) U10F.K11(GND) U10F.K15(GND) U10F.L2(GND) U10F.L8(GND) U10F.L9(VREFN_0) U10F.L10(VP_0) U10F.L22(GND) U10F.M7(GND) U10F.M9(VN_0) U10F.M10(VREFP_0) U10F.M11(GND) U10F.M19(GND) U10F.N6(GND) U10F.N8(GND) U10F.N9(DXN_0) U10F.N10(DXP_0) U10F.N16(GND) U10F.P3(GND) U10F.P7(GND) U10F.P9(GND) U10F.P11(GND) U10F.P13(GND) U10F.R8(GND) U10F.R10(GND) U10F.R12(GND) U10F.R20(GND) U10F.T7(GND) U10F.T9(GND) U10F.T11(GND) U10F.T17(GND) U10F.U4(GND) U10F.U10(M1_0) U10F.U14(GND) U10F.V1(GND) U10F.V11(GND) U10F.V21(GND) U10F.W8(GND) U10F.W18(GND) U10F.Y5(GND) U10F.Y15(GND) U11F.2(GND)
P1.0V: C10F.1 C11F.1 C12F.1 C38F.1 C39F.1 C41F.1 C42F.1 C43F.1 C44F.1 C45F.1 C46F.1 C47F.1 C48F.1 C49F.1 U10F.D6(MGTAVCC) U10F.D10(MGTAVCC) U10F.E8(MGTAVCC) U10F.F7(MGTAVCC) U10F.F9(MGTAVCC) U10F.H8(VCCINT) U10F.H10(VCCINT) U10F.J7(VCCINT) U10F.J9(VCCINT) U10F.J11(VCCBRAM) U10F.K8(VCCINT) U10F.L7(VCCINT) U10F.L11(VCCBRAM) U10F.M8(VCCINT) U10F.N7(VCCINT) U10F.N11(VCCBRAM) U10F.P8(VCCINT) U10F.P10(VCCINT) U10F.R7(VCCINT) U10F.R9(VCCINT) U10F.T8(VCCINT) U10F.T10(VCCINT)
P1.2VTT: C15F.1 C16F.1 C17F.1 C87F.1 C88F.1 R11F.2 U10F.B5(MGTAVTT) U10F.B7(MGTAVTT) U10F.B9(MGTAVTT) U10F.B11(MGTAVTT) U10F.C4(MGTAVTT) U10F.C8(MGTAVTT)
P1.5V_D: C59F.1 C60F.1 C61F.1 C62F.1 C63F.1 C64F.1 C65F.1 C73F.1 C74F.1 C75F.1 C76F.1 C77F.1 C78F.1 C79F.1 U10F.AA7(VCCO_34) U10F.AB4(VCCO_34) U10F.C1(VCCO_35) U10F.F2(VCCO_35) U10F.H6(VCCO_35) U10F.J3(VCCO_35) U10F.M4(VCCO_35) U10F.N1(VCCO_35) U10F.R5(VCCO_34) U10F.T2(VCCO_34) U10F.V6(VCCO_34) U10F.W3(VCCO_34)
P1.8V: C26F.1 C28F.1 C29F.1 C30F.1 C31F.1 C32F.1 C33F.1 C34F.1 C35F.1 U10F.E12(VCCBATT_0) U10F.H12(VCCAUX) U10F.K10(VCCADC_0) U10F.K12(VCCAUX) U10F.M12(VCCAUX) U10F.P12(VCCAUX) U10F.R11(VCCAUX)
P3.3V: C50F.1 C51F.1 C52F.1 C53F.1 C54F.1 C55F.1 C56F.1 C57F.1 C58F.1 C66F.1 C67F.1 C68F.1 C69F.1 C70F.1 C71F.1 C72F.1 C80F.1 C81F.1 C82F.1 C83F.1 C84F.1 C85F.1 C86F.1 C89F.1 P10F.2 R12F.2 R13F.2 R14F.2 U10F.A17(VCCO_16) U10F.AA17(VCCO_13) U10F.AB14(VCCO_13) U10F.B14(VCCO_16) U10F.C21(VCCO_16) U10F.D18(VCCO_16) U10F.E15(VCCO_16) U10F.F12(VCCO_0) U10F.F22(VCCO_16) U10F.G19(VCCO_15) U10F.H16(VCCO_15) U10F.J13(VCCO_15) U10F.K20(VCCO_15) U10F.L17(VCCO_15) U10F.M14(VCCO_14) U10F.N21(VCCO_15) U10F.P18(VCCO_14) U10F.R15(VCCO_14) U10F.T12(VCCO_0) U10F.T22(VCCO_14) U10F.U8(CFGBVS_0) U10F.U11(M0_0) U10F.U19(VCCO_14) U10F.V16(VCCO_13) U10F.W13(VCCO_13) U10F.Y10(VCCO_13) U10F.Y20(VCCO_14) U11F.1(OE) U11F.4(Vcc)
VTT_REF: C13F.1 C14F.1 C18F.1 C19F.1 U10F.E3(IO_L6N_T0_VREF_35) U10F.N3(IO_L19N_T3_VREF_35) U10F.V3(IO_L6N_T0_VREF_34) U10F.W7(IO_L19N_T3_VREF_34)
CEC_R: U10F.P20(IO_0_14)
DDC_SCL_LV_N: U10F.T18(IO_L20N_T3_A07_D23_14)
DDC_SDA_LV_N: U10F.V18(IO_L14P_T2_SRCC_14)
DDC_SDA_PD: U10F.F20(IO_L18N_T2_16)
DDC_SDA_PU: U10F.G20(IO_L8N_T1_AD10N_15)
DDR3_A0: U10F.U6(IO_L16P_T2_34)
DDR3_A1: U10F.V4(IO_L12P_T1_MRCC_34)
DDR3_A2: U10F.W5(IO_L15N_T2_DQS_34)
DDR3_A3: U10F.V5(IO_L16N_T2_34)
DDR3_A4: U10F.AA1(IO_L7P_T1_34)
DDR3_A5: U10F.Y2(IO_L4N_T0_34)
DDR3_A6: U10F.AB1(IO_L7N_T1_34)
DDR3_A7: U10F.AB3(IO_L8P_T1_34)
DDR3_A8: U10F.AB2(IO_L8N_T1_34)
DDR3_A9: U10F.Y3(IO_L9P_T1_DQS_34)
DDR3_A10: U10F.W6(IO_L15P_T2_DQS_34)
DDR3_A11: U10F.Y1(IO_L5N_T0_34)
DDR3_A12: U10F.V2(IO_L2N_T0_34)
DDR3_A13: U10F.AA3(IO_L9N_T1_DQS_34)
DDR3_BA0: U10F.U5(IO_L14N_T2_SRCC_34)
DDR3_BA1: U10F.W4(IO_L12N_T1_MRCC_34)
DDR3_BA2: U10F.V7(IO_L19P_T3_34)
DDR3_CAS_N: U10F.Y7(IO_L23N_T3_34)
DDR3_CK_N: U10F.R2(IO_L3N_T0_DQS_34)
DDR3_CK_P: U10F.R3(IO_L3P_T0_DQS_34)
DDR3_CKE: U10F.Y8(IO_L23P_T3_34)
DDR3_CS0_N: U10F.V9(IO_L21P_T3_DQS_34)
DDR3_DM0: U10F.G1(IO_L5P_T0_AD13P_35)
DDR3_DM1: U10F.H4(IO_L12P_T1_MRCC_35)
DDR3_DM2: U10F.M5(IO_L23N_T3_35)
DDR3_DM3: U10F.L3(IO_L14P_T2_SRCC_35)
DDR3_DQ0: U10F.C2(IO_L2P_T0_AD12P_35)
DDR3_DQ1: U10F.F1(IO_L5N_T0_AD13N_35)
DDR3_DQ2: U10F.B1(IO_L1P_T0_AD4P_35)
DDR3_DQ3: U10F.F3(IO_L6P_T0_35)
DDR3_DQ4: U10F.A1(IO_L1N_T0_AD4N_35)
DDR3_DQ5: U10F.D2(IO_L4N_T0_35)
DDR3_DQ6: U10F.B2(IO_L2N_T0_AD12N_35)
DDR3_DQ7: U10F.E2(IO_L4P_T0_35)
DDR3_DQ8: U10F.J5(IO_L10P_T1_AD15P_35)
DDR3_DQ9: U10F.H3(IO_L11P_T1_SRCC_35)
DDR3_DQ10: U10F.K1(IO_L7P_T1_AD6P_35)
DDR3_DQ11: U10F.H2(IO_L8P_T1_AD14P_35)
DDR3_DQ12: U10F.J1(IO_L7N_T1_AD6N_35)
DDR3_DQ13: U10F.G2(IO_L8N_T1_AD14N_35)
DDR3_DQ14: U10F.H5(IO_L10N_T1_AD15N_35)
DDR3_DQ15: U10F.G3(IO_L11N_T1_SRCC_35)
DDR3_DQ16: U10F.N2(IO_L22N_T3_35)
DDR3_DQ17: U10F.M6(IO_L23P_T3_35)
DDR3_DQ18: U10F.P1(IO_L20N_T3_35)
DDR3_DQ19: U10F.N5(IO_L24N_T3_35)
DDR3_DQ20: U10F.P2(IO_L22P_T3_35)
DDR3_DQ21: U10F.N4(IO_L19P_T3_35)
DDR3_DQ22: U10F.R1(IO_L20P_T3_35)
DDR3_DQ23: U10F.P6(IO_L24P_T3_35)
DDR3_DQ24: U10F.K3(IO_L14N_T2_SRCC_35)
DDR3_DQ25: U10F.M2(IO_L16N_T2_35)
DDR3_DQ26: U10F.K4(IO_L13P_T2_MRCC_35)
DDR3_DQ27: U10F.M3(IO_L16P_T2_35)
DDR3_DQ28: U10F.J6(IO_L17N_T2_35)
DDR3_DQ29: U10F.L5(IO_L18P_T2_35)
DDR3_DQ30: U10F.J4(IO_L13N_T2_MRCC_35)
DDR3_DQ31: U10F.K6(IO_L17P_T2_35)
DDR3_DQS0_N: U10F.D1(IO_L3N_T0_DQS_AD5N_35)
DDR3_DQS0_P: U10F.E1(IO_L3P_T0_DQS_AD5P_35)
DDR3_DQS1_N: U10F.J2(IO_L9N_T1_DQS_AD7N_35)
DDR3_DQS1_P: U10F.K2(IO_L9P_T1_DQS_AD7P_35)
DDR3_DQS2_N: U10F.P4(IO_L21N_T3_DQS_35)
DDR3_DQS2_P: U10F.P5(IO_L21P_T3_DQS_35)
DDR3_DQS3_N: U10F.L1(IO_L15N_T2_DQS_35)
DDR3_DQS3_P: U10F.M1(IO_L15P_T2_DQS_35)
DDR3_ODT0: U10F.W9(IO_L24P_T3_34)
DDR3_RAS_N: U10F.Y9(IO_L24N_T3_34)
DDR3_RESET_N: U10F.AB5(IO_L10N_T1_34)
DDR3_WE_N: U10F.V8(IO_L21N_T3_DQS_34)
FPGA_DONE: R14F.1 U10F.G11(DONE_0)
FPGA_INIT: R13F.1 U10F.U12(INIT_B_0)
FPGA_LED0: R18F.2 U10F.M21(IO_L10P_T1_AD11P_15)
FPGA_LED1: R17F.2 U10F.N20(IO_L18P_T2_A24_15)
FPGA_LED2: R16F.2 U10F.L21(IO_L10N_T1_AD11N_15)
FPGA_MODE: P10F.1 R15F.2 U10F.U9(M2_0)
FPGA_PROGRAM_B: R12F.1 U10F.N12(PROGRAM_B_0)
FPGA_PUDC: R10F.1 U10F.U22(IO_L3P_T0_DQS_PUDC_B_14)
FPGA_SPI_CS: U10F.T19(IO_L6P_T0_FCS_B_14)
FPGA_SPI_MISO_D1: U10F.R22(IO_L1N_T0_D01_DIN_14)
FPGA_SPI_MOSI_D0: U10F.P22(IO_L1P_T0_D00_MOSI_14)
FPGA_SPI_RES_D3: U10F.R21(IO_L2N_T0_D03_14)
FPGA_SPI_SCK: U10F.L12(CCLK_0)
FPGA_SPI_WP_D2: U10F.P21(IO_L2P_T0_D02_14)
FPGA_TCK: U10F.V12(TCK_0)
FPGA_TDI: U10F.R13(TDI_0)
FPGA_TDO: U10F.U13(TDO_0)
FPGA_TMS: U10F.T13(TMS_0)
FUSB_N: U10F.C15(IO_L3N_T0_DQS_16)
FUSB_P: U10F.C14(IO_L3P_T0_DQS_16)
HAX_0: U10F.B15(IO_L7P_T1_16)
HAX_1: U10F.B16(IO_L7N_T1_16)
HAX_2: U10F.B13(IO_L8N_T1_16)
HAX_3: U10F.A15(IO_L9P_T1_DQS_16)
HAX_4: U10F.A16(IO_L9N_T1_DQS_16)
HAX_5: U10F.A13(IO_L10P_T1_16)
HAX_6: U10F.A14(IO_L10N_T1_16)
HAX_7: U10F.B17(IO_L11P_T1_SRCC_16)
HAX_8: U10F.B18(IO_L11N_T1_SRCC_16)
HAX_9: U10F.C17(IO_L12N_T1_MRCC_16)
HAX_10: U10F.C18(IO_L13P_T2_MRCC_16)
HAX_11: U10F.C19(IO_L13N_T2_MRCC_16)
HAX_12: U10F.B20(IO_L16P_T2_16)
HAX_13: U10F.A20(IO_L16N_T2_16)
HAX_14: U10F.A18(IO_L17P_T2_16)
HAX_15: U10F.A19(IO_L17N_T2_16)
HAX_CLK_N: U10F.E6(MGTREFCLK0N_216)
HAX_CLK_P: U10F.F6(MGTREFCLK0P_216)
HDMI_HPD_LL_N: U10F.U17(IO_L18P_T2_A12_D28_14)
I2C0_SCL: U10F.F13(IO_L1P_T0_16)
I2C0_SDA: U10F.F14(IO_L1N_T0_16)
MCU_INT0: U10F.D15(IO_L6N_T0_VREF_16)
MCU_INT1: U10F.G13(IO_L1N_T0_AD0N_15)
OV0_CEC_R: U10F.P19(IO_L5P_T0_D06_14)
OV0_DDC_SCL_LV: U10F.W17(IO_L16N_T2_A15_D31_14)
OV0_DDC_SDA_LV: U10F.R17(IO_L24N_T3_A00_D16_14)
OV0_HDMI_HPD_LV: U10F.V17(IO_L16P_T2_CSI_B_14)
OV0_TMDS0_N: U10F.AB18(IO_L17N_T2_A13_D29_14)
OV0_TMDS0_P: U10F.AA18(IO_L17P_T2_A14_D30_14)
OV0_TMDS1_N: U10F.AA19(IO_L15P_T2_DQS_RDWR_B_14)
OV0_TMDS1_P: U10F.AB20(IO_L15N_T2_DQS_DOUT_CSO_B_14)
OV0_TMDS2_N: U10F.AB21(IO_L10P_T1_D14_14)
OV0_TMDS2_P: U10F.AB22(IO_L10N_T1_D15_14)
OV0_TMDS3_N: U10F.Y18(IO_L13P_T2_MRCC_14)
OV0_TMDS3_P: U10F.Y19(IO_L13N_T2_MRCC_14)
PCICLK_N: C23F.1 U10F.E10(MGTREFCLK1N_216)
PCICLK_P: C21F.1 U10F.F10(MGTREFCLK1P_216)
PER0_N: C25F.1
PER0_P: C24F.1
PER1_N: C36F.1
PER1_P: C27F.1
PER2_N: C40F.1
PER2_P: C37F.1
PER3_N: C22F.1
PER3_P: C20F.1
PERC0_N: C25F.2 U10F.C5(MGTPTXN1_216)
PERC0_P: C24F.2 U10F.D5(MGTPTXP1_216)
PERC1_N: C36F.2 U10F.A6(MGTPTXN2_216)
PERC1_P: C27F.2 U10F.B6(MGTPTXP2_216)
PERC2_N: C40F.2 U10F.C7(MGTPTXN3_216)
PERC2_P: C37F.2 U10F.D7(MGTPTXP3_216)
PERC3_N: C22F.2 U10F.A4(MGTPTXN0_216)
PERC3_P: C20F.2 U10F.B4(MGTPTXP0_216)
PERST#: U10F.E18(IO_L15N_T2_DQS_16)
PET0_N: U10F.C11(MGTPRXN1_216)
PET0_P: U10F.D11(MGTPRXP1_216)
PET1_N: U10F.A10(MGTPRXN2_216)
PET1_P: U10F.B10(MGTPRXP2_216)
PET2_N: U10F.C9(MGTPRXN3_216)
PET2_P: U10F.D9(MGTPRXP3_216)
PET3_N: U10F.A8(MGTPRXN0_216)
PET3_P: U10F.B8(MGTPRXP0_216)
REFCLK_N: C23F.2
REFCLK_P: C21F.2
RX0_FORCEPLUG: U10F.N22(IO_L15P_T2_DQS_15)
RX0_FORCEUNPLUG: U10F.M22(IO_L15N_T2_DQS_ADV_B_15)
RX0_TMDS0_N: U10F.K21(IO_L9P_T1_DQS_AD3P_15)
RX0_TMDS0_P: U10F.K22(IO_L9N_T1_DQS_AD3N_15)
RX0_TMDS1_N: U10F.J20(IO_L11P_T1_SRCC_15)
RX0_TMDS1_P: U10F.J21(IO_L11N_T1_SRCC_15)
RX0_TMDS2_N: U10F.J22(IO_L7P_T1_AD2P_15)
RX0_TMDS2_P: U10F.H22(IO_L7N_T1_AD2N_15)
RX0_TMDS3_N: U10F.L19(IO_L14P_T2_SRCC_15)
RX0_TMDS3_P: U10F.L20(IO_L14N_T2_SRCC_15)
SMCLK: U10F.D19(IO_L14N_T2_SRCC_16)
SMDAT: U10F.D20(IO_L19P_T3_16)
SYSCLK: U10F.J19(IO_L12P_T1_MRCC_15) U11F.3(OUT)
TX0_TMDS0_N: U10F.W22(IO_L7N_T1_D10_14)
TX0_TMDS0_P: U10F.W21(IO_L7P_T1_D09_14)
TX0_TMDS1_N: U10F.V20(IO_L11N_T1_SRCC_14)
TX0_TMDS1_P: U10F.U20(IO_L11P_T1_SRCC_14)
TX0_TMDS2_N: U10F.U21(IO_L4N_T0_D05_14)
TX0_TMDS2_P: U10F.T21(IO_L4P_T0_D04_14)
TX0_TMDS3_N: U10F.W19(IO_L12P_T1_MRCC_14)
TX0_TMDS3_P: U10F.W20(IO_L12N_T1_MRCC_14)
TX1_CEC: U10F.P17(IO_L21N_T3_DQS_A06_D22_14)
TX1_CLK_N: U10F.G21(IO_L24P_T3_16)
TX1_CLK_P: U10F.G22(IO_L24N_T3_16)
TX1_HPD_LL: U10F.U18(IO_L18N_T2_A11_D27_14)
TX1_SCL_LV: U10F.P16(IO_L24P_T3_A01_D17_14)
TX1_SDA_LV: U10F.R16(IO_L22N_T3_A04_D20_14)
TX1_TMDS0_N: U10F.E22(IO_L22P_T3_16)
TX1_TMDS0_P: U10F.D22(IO_L22N_T3_16)
TX1_TMDS1_N: U10F.C22(IO_L20P_T3_16)
TX1_TMDS1_P: U10F.B22(IO_L20N_T3_16)
TX1_TMDS2_N: U10F.B21(IO_L21P_T3_DQS_16)
TX1_TMDS2_P: U10F.A21(IO_L21N_T3_DQS_16)
UART0_RX: U10F.E13(IO_L4P_T0_16)
UART0_TX: U10F.E14(IO_L4N_T0_16)
WAKE#: U10F.E19(IO_L14P_T2_SRCC_16)
NetD10F_1: D10F.1(A) R16F.1
NetD11F_1: D11F.1(A) R17F.1
NetD12F_1: D12F.1(A) R18F.1
NetR11F_1: R11F.1 U10F.F8(MGTRREF_216)

Not connected (* = marked no-connect by the designer): U10F AA4(IO_L11N_T1_SRCC_34) AA5(IO_L10P_T1_34) AA6(IO_L18N_T2_34) AA8(IO_L22P_T3_34) AA9(NC) AA10(NC) AA11(NC) AA13(NC) AA14(NC) AA15(NC) AA16(NC) AA20(IO_L8P_T1_D11_14) AA21(IO_L8N_T1_D12_14) AB6(IO_L20N_T3_34) AB7(IO_L20P_T3_34) AB8(IO_L22N_T3_34) AB10(NC) AB11(NC) AB12(NC) AB13(NC) AB15(NC) AB16(NC) AB17(NC) C13(IO_L8P_T1_16) C20(IO_L19N_T3_VREF_16) D14(IO_L6P_T0_16) D16(IO_L5N_T0_16) D17(IO_L12P_T1_MRCC_16) D21(IO_L23N_T3_16) E16(IO_L5P_T0_16) E17(IO_L2N_T0_16) E21(IO_L23P_T3_16) F4(IO_0_35) F15(IO_0_16) F16(IO_L2P_T0_16) F18(IO_L15P_T2_DQS_16) F19(IO_L18P_T2_16) F21(IO_25_16) G4(IO_L12N_T1_MRCC_35) G15(IO_L2P_T0_AD8P_15) G16(IO_L2N_T0_AD8N_15) G17(IO_L4P_T0_15) G18(IO_L4N_T0_15) H13(IO_L1P_T0_AD0P_15) H14(IO_L3N_T0_DQS_AD1N_15) H15(IO_L5N_T0_AD9N_15) H17(IO_L6P_T0_15) H18(IO_L6N_T0_VREF_15) H19(IO_L12N_T1_MRCC_15) H20(IO_L8P_T1_AD10P_15) J14(IO_L3P_T0_DQS_AD1P_15) J15(IO_L5P_T0_AD9P_15) J16(IO_0_15) J17(IO_L21N_T3_DQS_A18_15) K13(IO_L19P_T3_A22_15) K14(IO_L19N_T3_A21_VREF_15) K16(IO_L23N_T3_FWE_B_15) K17(IO_L21P_T3_DQS_15) K18(IO_L13P_T2_MRCC_15) K19(IO_L13N_T2_MRCC_15) L4(IO_L18N_T2_35) L6(IO_25_35) L13(IO_L20N_T3_A19_15) L14(IO_L22P_T3_A17_15) L15(IO_L22N_T3_A16_15) L16(IO_L23P_T3_FOE_B_15) L18(IO_L16N_T2_A27_15) M13(IO_L20P_T3_A20_15) M15(IO_L24P_T3_RS1_15) M16(IO_L24N_T3_RS0_15) M17(IO_25_15) M18(IO_L16P_T2_A28_15) M20(IO_L18N_T2_A23_15) N13(IO_L23P_T3_A03_D19_14) N14(IO_L23N_T3_A02_D18_14) N15(IO_25_14) N17(IO_L21P_T3_DQS_14) N18(IO_L17P_T2_A26_15) N19(IO_L17N_T2_A25_15) P14(IO_L19P_T3_A10_D26_14) P15(IO_L22P_T3_A05_D21_14) R4(IO_L13P_T2_MRCC_34) R6(IO_L17P_T2_34) R14(IO_L19N_T3_A09_D25_VREF_14) R18(IO_L20P_T3_A08_D24_14) R19(IO_L5N_T0_D07_14) T1(IO_L1P_T0_34) T3(IO_0_34) T4(IO_L13N_T2_MRCC_34) T5(IO_L14P_T2_SRCC_34) T6(IO_L17N_T2_34) T14(NC) T15(NC) T16(NC) T20(IO_L6N_T0_D08_VREF_14) U1(IO_L1N_T0_34) U2(IO_L2P_T0_34) U3(IO_L6P_T0_34) U7(IO_25_34) U15(NC) U16(NC) V10(NC) V13(NC) V14(NC) V15(NC) V19(IO_L14N_T2_SRCC_14) V22(IO_L3N_T0_DQS_EMCCLK_14) W1(IO_L5P_T0_34) W2(IO_L4P_T0_34) W10(NC) W11(NC) W12(NC) W14(NC) W15(NC) W16(NC) Y4(IO_L11P_T1_SRCC_34) Y6(IO_L18P_T2_34) Y11(NC) Y12(NC) Y13(NC) Y14(NC) Y16(NC) Y17(NC) Y21(IO_L9P_T1_DQS_14) Y22(IO_L9N_T1_DQS_D13_14)

### Layout directives
differential pair: DDR3_CK_N, DDR3_CK_P, DDR3_DQS0_N, DDR3_DQS0_P, DDR3_DQS1_N, DDR3_DQS1_P, DDR3_DQS2_N, DDR3_DQS2_P, DDR3_DQS3_N, DDR3_DQS3_P, HAX_CLK_N, HAX_CLK_P, PCICLK_N, PCICLK_P, PER0_N, PER0_P, PER1_N, PER1_P, PER2_N, PER2_P, PER3_N, PER3_P, PERC0_N, PERC0_P, PERC1_N, PERC1_P, PERC2_N, PERC2_P, PERC3_N, PERC3_P, PET0_N, PET0_P, PET1_N, PET1_P, PET2_N, PET2_P, PET3_N, PET3_P, REFCLK_N, REFCLK_P
net class PCIE_DAT: PER0_N, PER0_P, PER1_N, PER1_P, PER2_N, PER2_P, PER3_N, PER3_P, PERC0_N, PERC0_P, PERC1_N, PERC1_P, PERC2_N, PERC2_P, PERC3_N, PERC3_P, PET0_N, PET0_P, PET1_N, PET1_P, PET2_N, PET2_P, PET3_N, PET3_P
net class PCIE_CLK: HAX_CLK_N, HAX_CLK_P, PCICLK_N, PCICLK_P, REFCLK_N, REFCLK_P

### Notes on the sheet
- HDMI/CFG/AUX
- HDMI/AUX
- HAX IO
- DDR3
- inversion
- (near U10F) connect extra bank 13 to VCCO_13 improve ESD
- Config I/O voltage = 3.3V
- (in symbol XC7A35T-2FGG484C, part A) BANK 14
- (in symbol XC7A35T-2FGG484C, part B) BANK 15
- (in symbol XC7A35T-2FGG484C, part C) BANK 16
- (in symbol XC7A35T-2FGG484C, part D) BANK 34
- (in symbol XC7A35T-2FGG484C, part E) BANK 35

### Library data of the parts
C10F C17F C28F C29F C38F C46F C47F C48F C56F C57F C58F C63F C64F C65F C70F C71F C72F C77F C78F C79F C84F C85F C86F = Cap Semi: Capacitor (Semiconductor SIM Model); MPN: CL05A475MQ5NQNC; VENDOR: Samsung; MYPN: C-475-6p3-X5R-0402
C11F C12F C15F C16F C20F C21F C22F C23F C24F C25F C27F C36F C37F C40F C87F C88F C89F = Cap Semi: as C37P on sheet 01power
C13F C14F C18F C19F C26F C30F C31F C32F C33F C34F C39F C41F C42F C43F C44F C45F C51F C52F C53F C54F C55F C59F C60F C61F C62F C66F C67F C68F C69F C73F C74F C75F C76F C80F C81F C82F C83F = Cap Semi: Capacitor (Semiconductor SIM Model); MPN: CL03A474KQ3NNNH; VENDOR: Samsung; MYPN: C-474-6p3-X5R-0201
C35F C49F C50F = Cap Semi: Capacitor (Semiconductor SIM Model); MPN: CL31A107MQHNNNE; VENDOR: Samsung; MYPN: C-107-6p3-X5R-1206
D10F D11F D12F = LED2: as D11P on sheet 01power
P10F = Header 2: Header, 2-Pin; LatestRevisionDate: 17-Jul-2002; LatestRevisionNote: Re-released for DXP Platform.; Publisher: Altium Limited; VENDOR: DNP; MPN: DNP; MYPN: DNP
R10F = Res1: Resistor; MPN: RS02U102FT; VENDOR: Fenghua; MYPN: R-102-1P-1_16W-0402
R11F = Res1: Resistor; VENDOR: ANY; MYPN: R-101-1P-1_16W-0402; MPN: ANY
R12F R13F = Res1: as R21C on sheet 02config; MPN: ANY
R14F = Res1: as R32P on sheet 01power
R15F = Res1: Resistor; VENDOR: ANY; MYPN: R-102-1P-1_16W-0402; MPN: ANY
R16F R17F R18F = Res1: as R20C on sheet 02config
U10F = XC7A35T-2FGG484C: Artix-7 FPGA, 250 User I/Os, 4 GTP, 484-Ball BGA, Speed Grade 2, Commercial Grade, Pb-Free; Manufacturer: Xilinx; Total Block RAM: 1800 Kb; GTP: 4; Clock Mgmt Tiles (CMTs): 5; Logic Cells: 33280; Available User I/O: 250; Speed Grades: 2; MYPN: U-XC7A35T-2FGG484C; DatasheetVersion: v1.15; PackageVersion: Rev. 1.11; PackageReference: FGG484; PackageDescription: 484-Ball Wire-Bond Fine-Pitch BGA, Body 23 x 23 mm, Pitch 1 mm; Maximum Distributed RAM: 400 Kb; Operating Temperature Range: Commercial; NexusDeviceID: XC7A35T-2FGG484C; Mounting Technology: Surface Mount; PartNumber: XC7A35T-2FGG484C; ComponentLink1Description: Manufacturer URL; ComponentLink1URL: http://www.xilinx.com/; ComponentLink2Description: Datasheet; ComponentLink2URL: http://www.xilinx.com/support/documentation/data_sheets/ds180_7Series_Overview.pdf; ComponentLink3Description: Package Specification; ComponentLink3URL: http://www.xilinx.com/support/documentation/user_guides/ug475_7Series_Pkg_Pinout.pdf; ComponentLink4Description: DC and Switching Characteristics; ComponentLink4URL: http://www.xilinx.com/support/documentation/data_sheets/ds181_Artix_7_Data_Sheet.pdf; ComponentLink5Description: Package File; ComponentLink5URL: http://www.xilinx.com/support/packagefiles/a7packages/xc7a200tsbg484pkg.txt; ComponentLink6Description: Packaging and Pinout; ComponentLink6URL: http://www.xilinx.com/support/documentation/user_guides/ug475_7Series_Pkg_Pinout.pdf; MPN: XC7A35T-2FGG484C; VENDOR: Xilinx
U11F = OSCILLATOR: Abracon ASDMB Miniature Oscillator; MPN: ASDMB-50.000MHZ-LC-T; VENDOR: Abracon LLC; MYPN: U-ASDMB-50MHz

## Sheet 04ddr3.SchDoc
size B
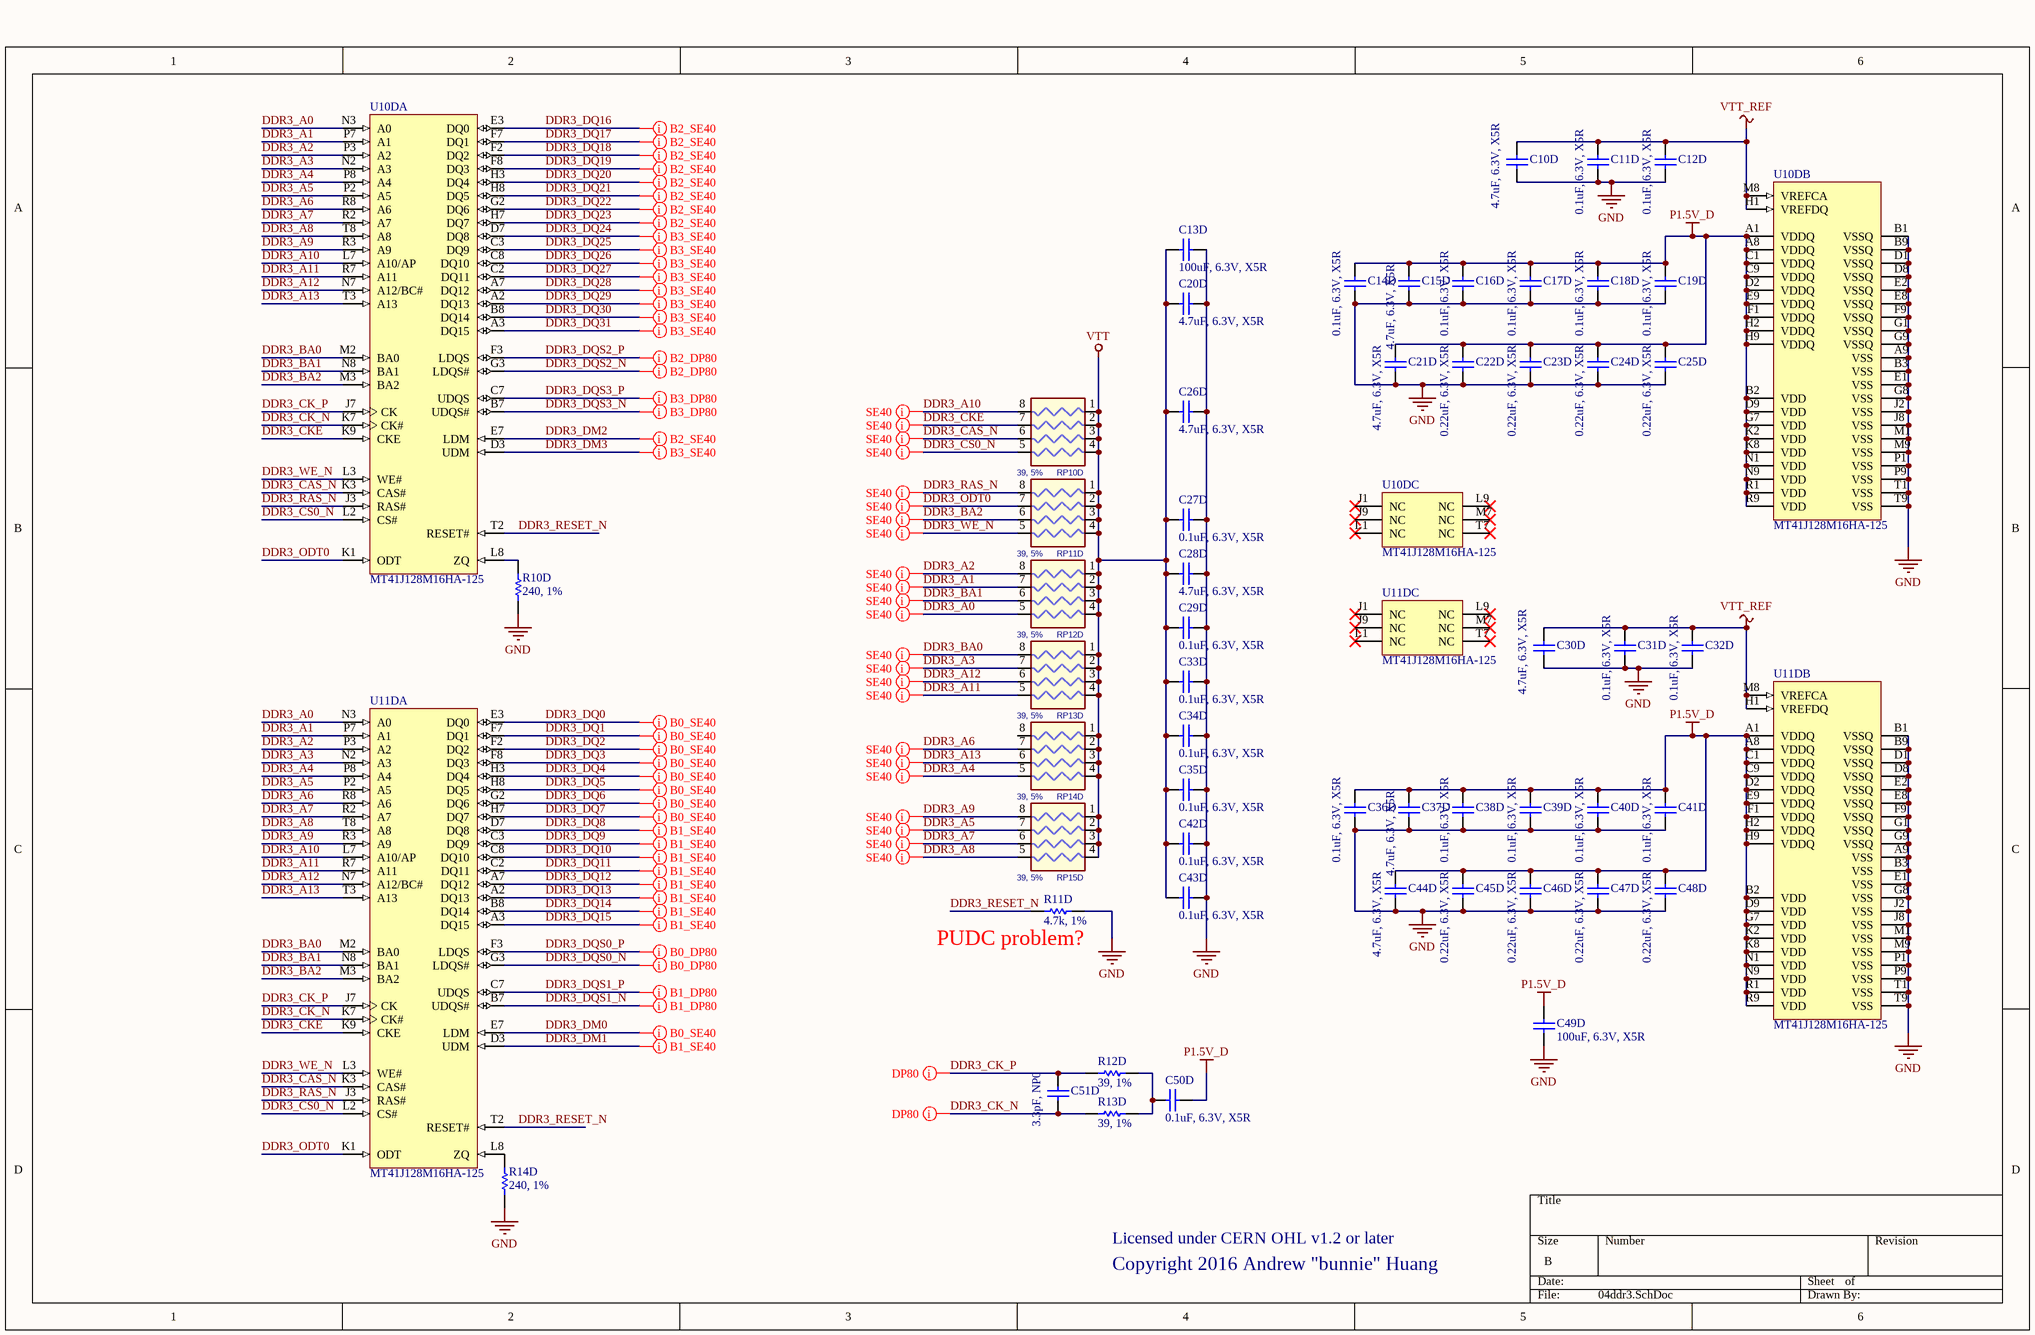
[diagram p4: 04ddr3.SchDoc]

### Parts
C10D  4.7uF, 6.3V, X5R  [CAPC1005N]
C11D  0.1uF, 6.3V, X5R  [CAPC0603X03L]
C12D  0.1uF, 6.3V, X5R  [CAPC0603X03L]
C13D  100uF, 6.3V, X5R  [CAPC3216N]
C14D  0.1uF, 6.3V, X5R  [CAPC0603X03L]
C15D  4.7uF, 6.3V, X5R  [CAPC1005N]
C16D  0.1uF, 6.3V, X5R  [CAPC0603X03L]
C17D  0.1uF, 6.3V, X5R  [CAPC0603X03L]
C18D  0.1uF, 6.3V, X5R  [CAPC0603X03L]
C19D  0.1uF, 6.3V, X5R  [CAPC0603X03L]
C20D  4.7uF, 6.3V, X5R  [CAPC1005N]
C21D  4.7uF, 6.3V, X5R  [CAPC1005N]
C22D  0.22uF, 6.3V, X5R  [CAPC0603X03L]
C23D  0.22uF, 6.3V, X5R  [CAPC0603X03L]
C24D  0.22uF, 6.3V, X5R  [CAPC0603X03L]
C25D  0.22uF, 6.3V, X5R  [CAPC0603X03L]
C26D  4.7uF, 6.3V, X5R  [CAPC1005N]
C27D  0.1uF, 6.3V, X5R  [CAPC0603X03L]
C28D  4.7uF, 6.3V, X5R  [CAPC1005N]
C29D  0.1uF, 6.3V, X5R  [CAPC0603X03L]
C30D  4.7uF, 6.3V, X5R  [CAPC1005N]
C31D  0.1uF, 6.3V, X5R  [CAPC0603X03L]
C32D  0.1uF, 6.3V, X5R  [CAPC0603X03L]
C33D  0.1uF, 6.3V, X5R  [CAPC0603X03L]
C34D  0.1uF, 6.3V, X5R  [CAPC0603X03L]
C35D  0.1uF, 6.3V, X5R  [CAPC0603X03L]
C36D  0.1uF, 6.3V, X5R  [CAPC0603X03L]
C37D  4.7uF, 6.3V, X5R  [CAPC1005N]
C38D  0.1uF, 6.3V, X5R  [CAPC0603X03L]
C39D  0.1uF, 6.3V, X5R  [CAPC0603X03L]
C40D  0.1uF, 6.3V, X5R  [CAPC0603X03L]
C41D  0.1uF, 6.3V, X5R  [CAPC0603X03L]
C42D  0.1uF, 6.3V, X5R  [CAPC0603X03L]
C43D  0.1uF, 6.3V, X5R  [CAPC0603X03L]
C44D  4.7uF, 6.3V, X5R  [CAPC1005N]
C45D  0.22uF, 6.3V, X5R  [CAPC0603X03L]
C46D  0.22uF, 6.3V, X5R  [CAPC0603X03L]
C47D  0.22uF, 6.3V, X5R  [CAPC0603X03L]
C48D  0.22uF, 6.3V, X5R  [CAPC0603X03L]
C49D  100uF, 6.3V, X5R  [CAPC3216N]
C50D  0.1uF, 6.3V, X5R  [CAPC0603X03L]
C51D  3.3pF, NP0  [CAPC0603X03L]
R10D  240, 1%  [CAPC0603X03L]
R11D  4.7k, 1%  [RESC1005N]
R12D  39, 1%  [RESC1005N]
R13D  39, 1%  [RESC1005N]
R14D  240, 1%  [CAPC0603X03L]
RP10D  39, 5%  [PANASONIC_EXB28V]
RP11D  39, 5%  [PANASONIC_EXB28V]
RP12D  39, 5%  [PANASONIC_EXB28V]
RP13D  39, 5%  [PANASONIC_EXB28V]
RP14D  39, 5%  [PANASONIC_EXB28V]
RP15D  39, 5%  [PANASONIC_EXB28V]
U10D  MT41J128M16HA-125  [MICT-HA-96]  (parts A,B,C of 3)
U11D  MT41J128M16HA-125  [MICT-HA-96]  (parts A,B,C of 3)

### Nets
GND: C10D.1 C11D.2 C12D.2 C13D.2 C14D.2 C15D.2 C16D.2 C17D.2 C18D.2 C19D.2 C20D.2 C21D.2 C22D.2 C23D.2 C24D.2 C25D.2 C26D.2 C27D.1 C28D.2 C29D.1 C30D.1 C31D.2 C32D.2 C33D.1 C34D.1 C35D.1 C36D.2 C37D.2 C38D.2 C39D.2 C40D.2 C41D.2 C42D.1 C43D.1 C44D.2 C45D.2 C46D.2 C47D.2 C48D.2 C49D.1 R10D.1 R11D.1 R14D.1 U10D.A9(VSS) U10D.B1(VSSQ) U10D.B3(VSS) U10D.B9(VSSQ) U10D.D1(VSSQ) U10D.D8(VSSQ) U10D.E1(VSS) U10D.E2(VSSQ) U10D.E8(VSSQ) U10D.F9(VSSQ) U10D.G1(VSSQ) U10D.G8(VSS) U10D.G9(VSSQ) U10D.J2(VSS) U10D.J8(VSS) U10D.M1(VSS) U10D.M9(VSS) U10D.P1(VSS) U10D.P9(VSS) U10D.T1(VSS) U10D.T9(VSS) U11D.A9(VSS) U11D.B1(VSSQ) U11D.B3(VSS) U11D.B9(VSSQ) U11D.D1(VSSQ) U11D.D8(VSSQ) U11D.E1(VSS) U11D.E2(VSSQ) U11D.E8(VSSQ) U11D.F9(VSSQ) U11D.G1(VSSQ) U11D.G8(VSS) U11D.G9(VSSQ) U11D.J2(VSS) U11D.J8(VSS) U11D.M1(VSS) U11D.M9(VSS) U11D.P1(VSS) U11D.P9(VSS) U11D.T1(VSS) U11D.T9(VSS)
P1.5V_D: C14D.1 C15D.1 C16D.1 C17D.1 C18D.1 C19D.1 C21D.1 C22D.1 C23D.1 C24D.1 C25D.1 C36D.1 C37D.1 C38D.1 C39D.1 C40D.1 C41D.1 C44D.1 C45D.1 C46D.1 C47D.1 C48D.1 C49D.2 C50D.1 U10D.A1(VDDQ) U10D.A8(VDDQ) U10D.B2(VDD) U10D.C1(VDDQ) U10D.C9(VDDQ) U10D.D2(VDDQ) U10D.D9(VDD) U10D.E9(VDDQ) U10D.F1(VDDQ) U10D.G7(VDD) U10D.H2(VDDQ) U10D.H9(VDDQ) U10D.K2(VDD) U10D.K8(VDD) U10D.N1(VDD) U10D.N9(VDD) U10D.R1(VDD) U10D.R9(VDD) U11D.A1(VDDQ) U11D.A8(VDDQ) U11D.B2(VDD) U11D.C1(VDDQ) U11D.C9(VDDQ) U11D.D2(VDDQ) U11D.D9(VDD) U11D.E9(VDDQ) U11D.F1(VDDQ) U11D.G7(VDD) U11D.H2(VDDQ) U11D.H9(VDDQ) U11D.K2(VDD) U11D.K8(VDD) U11D.N1(VDD) U11D.N9(VDD) U11D.R1(VDD) U11D.R9(VDD)
VTT: C13D.1 C20D.1 C26D.1 C27D.2 C28D.1 C29D.2 C33D.2 C34D.2 C35D.2 C42D.2 C43D.2 RP10D.1(R1) RP10D.2(R2) RP10D.3(R3) RP10D.4(R4) RP11D.1(R1) RP11D.2(R2) RP11D.3(R3) RP11D.4(R4) RP12D.1(R1) RP12D.2(R2) RP12D.3(R3) RP12D.4(R4) RP13D.1(R1) RP13D.2(R2) RP13D.3(R3) RP13D.4(R4) RP14D.1(R1) RP14D.2(R2) RP14D.3(R3) RP14D.4(R4) RP15D.1(R1) RP15D.2(R2) RP15D.3(R3) RP15D.4(R4)
VTT_REF: C10D.2 C11D.1 C12D.1 C30D.2 C31D.1 C32D.1 U10D.H1(VREFDQ) U10D.M8(VREFCA) U11D.H1(VREFDQ) U11D.M8(VREFCA)
DDR3_A0: RP12D.5(R42) U10D.N3(A0) U11D.N3(A0)
DDR3_A1: RP12D.7(R22) U10D.P7(A1) U11D.P7(A1)
DDR3_A2: RP12D.8(R12) U10D.P3(A2) U11D.P3(A2)
DDR3_A3: RP13D.7(R22) U10D.N2(A3) U11D.N2(A3)
DDR3_A4: RP14D.5(R42) U10D.P8(A4) U11D.P8(A4)
DDR3_A5: RP15D.7(R22) U10D.P2(A5) U11D.P2(A5)
DDR3_A6: RP14D.7(R22) U10D.R8(A6) U11D.R8(A6)
DDR3_A7: RP15D.6(R32) U10D.R2(A7) U11D.R2(A7)
DDR3_A8: RP15D.5(R42) U10D.T8(A8) U11D.T8(A8)
DDR3_A9: RP15D.8(R12) U10D.R3(A9) U11D.R3(A9)
DDR3_A10: RP10D.8(R12) U10D.L7(A10/AP) U11D.L7(A10/AP)
DDR3_A11: RP13D.5(R42) U10D.R7(A11) U11D.R7(A11)
DDR3_A12: RP13D.6(R32) U10D.N7(A12/BC#) U11D.N7(A12/BC#)
DDR3_A13: RP14D.6(R32) U10D.T3(A13) U11D.T3(A13)
DDR3_BA0: RP13D.8(R12) U10D.M2(BA0) U11D.M2(BA0)
DDR3_BA1: RP12D.6(R32) U10D.N8(BA1) U11D.N8(BA1)
DDR3_BA2: RP11D.6(R32) U10D.M3(BA2) U11D.M3(BA2)
DDR3_CAS_N: RP10D.6(R32) U10D.K3(CAS#) U11D.K3(CAS#)
DDR3_CK_N: C51D.1 R13D.1 U10D.K7(CK#) U11D.K7(CK#)
DDR3_CK_P: C51D.2 R12D.1 U10D.J7(CK) U11D.J7(CK)
DDR3_CKE: RP10D.7(R22) U10D.K9(CKE) U11D.K9(CKE)
DDR3_CS0_N: RP10D.5(R42) U10D.L2(CS#) U11D.L2(CS#)
DDR3_DM0: U11D.E7(LDM)
DDR3_DM1: U11D.D3(UDM)
DDR3_DM2: U10D.E7(LDM)
DDR3_DM3: U10D.D3(UDM)
DDR3_DQ0: U11D.E3(DQ0)
DDR3_DQ1: U11D.F7(DQ1)
DDR3_DQ2: U11D.F2(DQ2)
DDR3_DQ3: U11D.F8(DQ3)
DDR3_DQ4: U11D.H3(DQ4)
DDR3_DQ5: U11D.H8(DQ5)
DDR3_DQ6: U11D.G2(DQ6)
DDR3_DQ7: U11D.H7(DQ7)
DDR3_DQ8: U11D.D7(DQ8)
DDR3_DQ9: U11D.C3(DQ9)
DDR3_DQ10: U11D.C8(DQ10)
DDR3_DQ11: U11D.C2(DQ11)
DDR3_DQ12: U11D.A7(DQ12)
DDR3_DQ13: U11D.A2(DQ13)
DDR3_DQ14: U11D.B8(DQ14)
DDR3_DQ15: U11D.A3(DQ15)
DDR3_DQ16: U10D.E3(DQ0)
DDR3_DQ17: U10D.F7(DQ1)
DDR3_DQ18: U10D.F2(DQ2)
DDR3_DQ19: U10D.F8(DQ3)
DDR3_DQ20: U10D.H3(DQ4)
DDR3_DQ21: U10D.H8(DQ5)
DDR3_DQ22: U10D.G2(DQ6)
DDR3_DQ23: U10D.H7(DQ7)
DDR3_DQ24: U10D.D7(DQ8)
DDR3_DQ25: U10D.C3(DQ9)
DDR3_DQ26: U10D.C8(DQ10)
DDR3_DQ27: U10D.C2(DQ11)
DDR3_DQ28: U10D.A7(DQ12)
DDR3_DQ29: U10D.A2(DQ13)
DDR3_DQ30: U10D.B8(DQ14)
DDR3_DQ31: U10D.A3(DQ15)
DDR3_DQS0_N: U11D.G3(LDQS#)
DDR3_DQS0_P: U11D.F3(LDQS)
DDR3_DQS1_N: U11D.B7(UDQS#)
DDR3_DQS1_P: U11D.C7(UDQS)
DDR3_DQS2_N: U10D.G3(LDQS#)
DDR3_DQS2_P: U10D.F3(LDQS)
DDR3_DQS3_N: U10D.B7(UDQS#)
DDR3_DQS3_P: U10D.C7(UDQS)
DDR3_ODT0: RP11D.7(R22) U10D.K1(ODT) U11D.K1(ODT)
DDR3_RAS_N: RP11D.8(R12) U10D.J3(RAS#) U11D.J3(RAS#)
DDR3_RESET_N: R11D.2 U10D.T2(RESET#) U11D.T2(RESET#)
DDR3_WE_N: RP11D.5(R42) U10D.L3(WE#) U11D.L3(WE#)
NetC50D_2: C50D.2 R12D.2 R13D.2
NetR10D_2: R10D.2 U10D.L8(ZQ)
NetR14D_2: R14D.2 U11D.L8(ZQ)

Not connected (* = marked no-connect by the designer): RP14D 8(R12); U10D J1(NC)* J9(NC)* L1(NC)* L9(NC)* M7(NC)* T7(NC)*; U11D J1(NC)* J9(NC)* L1(NC)* L9(NC)* M7(NC)* T7(NC)*

### Layout directives
net class SE40: DDR3_A0, DDR3_A1, DDR3_A2, DDR3_A3, DDR3_A4, DDR3_A5, DDR3_A6, DDR3_A7, DDR3_A8, DDR3_A9, DDR3_A10, DDR3_A11, DDR3_A12, DDR3_A13, DDR3_BA0, DDR3_BA1, DDR3_BA2, DDR3_CAS_N, DDR3_CKE, DDR3_CS0_N, DDR3_ODT0, DDR3_RAS_N, DDR3_WE_N
net class DP80: DDR3_CK_N, DDR3_CK_P
net class B0_SE40: DDR3_DM0, DDR3_DQ0, DDR3_DQ1, DDR3_DQ2, DDR3_DQ3, DDR3_DQ4, DDR3_DQ5, DDR3_DQ6, DDR3_DQ7
net class B2_SE40: DDR3_DM2, DDR3_DQ16, DDR3_DQ17, DDR3_DQ18, DDR3_DQ19, DDR3_DQ20, DDR3_DQ21, DDR3_DQ22, DDR3_DQ23
net class B1_SE40: DDR3_DM1, DDR3_DQ8, DDR3_DQ9, DDR3_DQ10, DDR3_DQ11, DDR3_DQ12, DDR3_DQ13, DDR3_DQ14, DDR3_DQ15
net class B3_SE40: DDR3_DM3, DDR3_DQ24, DDR3_DQ25, DDR3_DQ26, DDR3_DQ27, DDR3_DQ28, DDR3_DQ29, DDR3_DQ30, DDR3_DQ31
net class B3_DP80: DDR3_DQS3_N, DDR3_DQS3_P
net class B2_DP80: DDR3_DQS2_N, DDR3_DQS2_P
net class B1_DP80: DDR3_DQS1_N, DDR3_DQS1_P
net class B0_DP80: DDR3_DQS0_N, DDR3_DQS0_P

### Notes on the sheet
- (near R11D) PUDC problem?
- Licensed under CERN OHL v1.2 or later
- Copyright 2016 Andrew "bunnie" Huang

### Library data of the parts
C10D C15D C20D C21D C26D C28D C30D C37D C44D = Cap Semi: as C10F on sheet 03fpga
C11D C12D C14D C16D C17D C18D C19D C27D C29D C31D C32D C33D C34D C35D C36D C38D C39D C40D C41D C42D C43D C50D = Cap Semi: as C37P on sheet 01power
C13D C49D = Cap Semi: as C35F on sheet 03fpga
C22D C23D C24D C25D C45D C46D C47D C48D = Cap Semi: as C31P on sheet 01power
C51D = Cap Semi: Capacitor (Semiconductor SIM Model); MPN: GRM0335C1H3R3CA01D; VENDOR: Murata; MYPN: C-3R3-50-NP0-0201
R10D R14D = Res1: Resistor; VENDOR: ANY; MYPN: R-241-1P-1_16W-0201; MPN: ANY
R11D = Res1: as R21C on sheet 02config; MPN: ANY
R12D R13D = Res1: Resistor; VENDOR: ANY; MYPN: R-390-1P-1_16W-0402; MPN: ANY
RP10D RP11D RP12D RP13D RP14D RP15D = RPACK4: MPN: RP104PJ390CS; MYPN: R-390-RP4-0402-5P-CVEX; VENDOR: Samsung
U10D = MT41J128M16HA-125: 2Gb DDR3-1600 SDRAM, 128Mb x 16, 1.25ns, 1.5V, 0 to 95 degC, 96-Ball FBGA, Pb-Free; MPN: MT41J128M16JT-125:K; CL: CL = 11; Clock Rate: 800 MHz; Op. Temp.: 0C to +95C; VENDOR: Micron; MYPN: UDDR3-128M16-125-96BGA; DatasheetVersion: Rev. P; PackageVersion: Rev.E; PackageReference: MICT-HA-96; PackageDescription: 96-Ball Fine-Pitch Ball Grid Array, 14 x 9 mm, Pitch 0.8 mm; Cycle Time: 1.25ns; Data Rate: DDR3-1600; Density: 2Gb; Depth: 128Mb; Package: FBGA; Pin Count: 96-ball; RoHS: Yes; Voltage: 1.5V; Width: x16; Mounting Technology: Surface Mount; ComponentLink1Description: Manufacturer URL; ComponentLink1URL: http://www.micron.com/; ComponentLink2Description: Datasheet; ComponentLink2URL: http://www.micron.com/~/media/Documents/Products/Data%20Sheet/DRAM/2Gb_DDR3_SDRAM.pdf; ComponentLink3Description: Package Specification; ComponentLink3URL: http://www.micron.com/~/media/Documents/Products/Data%20Sheet/DRAM/4Gb_1_35V_DDR3L.pdf
U11D = MT41J128M16HA-125: 2Gb DDR3-1600 SDRAM, 128Mb x 16, 1.25ns, 1.5V, 0 to 95 degC, 96-Ball FBGA, Pb-Free; MPN: MT41J128M16JT-125:K; CL: CL = 11; Clock Rate: 800 MHz; Op. Temp.: 0C to +95C; Vendor: Micron; MYPN: UDDR3-128M16-125-96BGA; DatasheetVersion: Rev. P; PackageVersion: Rev.E; PackageReference: MICT-HA-96; PackageDescription: 96-Ball Fine-Pitch Ball Grid Array, 14 x 9 mm, Pitch 0.8 mm; Cycle Time: 1.25ns; Data Rate: DDR3-1600; Density: 2Gb; Depth: 128Mb; Package: FBGA; Pin Count: 96-ball; RoHS: Yes; Voltage: 1.5V; Width: x16; Mounting Technology: Surface Mount; ComponentLink1Description: Manufacturer URL; ComponentLink1URL: http://www.micron.com/; ComponentLink2Description: Datasheet; ComponentLink2URL: http://www.micron.com/~/media/Documents/Products/Data%20Sheet/DRAM/2Gb_DDR3_SDRAM.pdf; ComponentLink3Description: Package Specification; ComponentLink3URL: http://www.micron.com/~/media/Documents/Products/Data%20Sheet/DRAM/4Gb_1_35V_DDR3L.pdf